# EAGLE design badge (EAGLE 9.6.2)

## Sheet 1 of 5
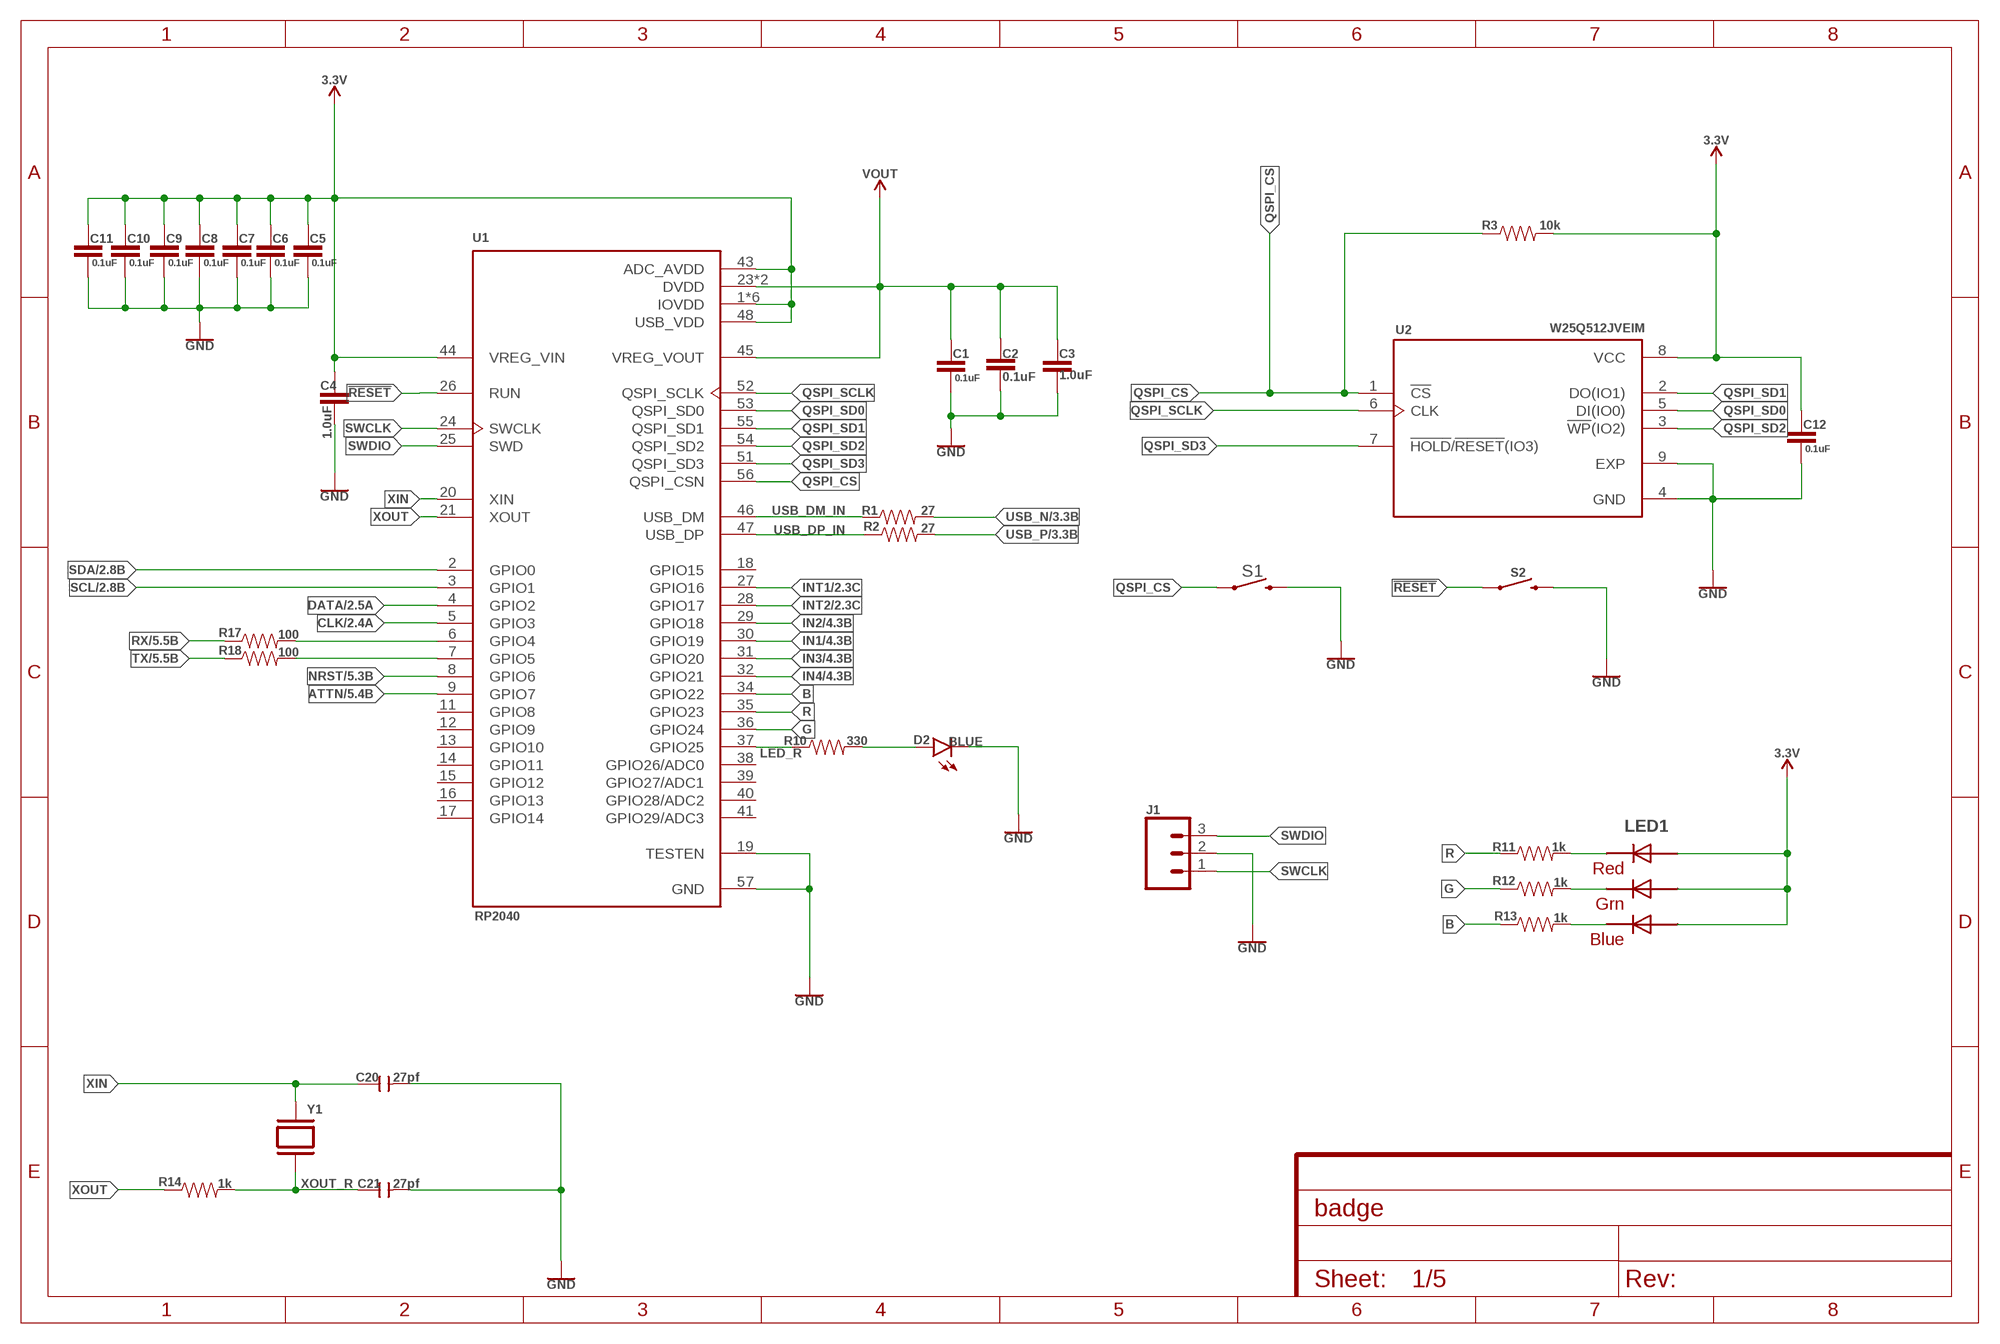
[diagram p0: schematic, sheet 1]

### Parts
C1  0.1uF  0.1UF-0603-25V-(+80/-20%)  [0603]
C2  0.1uF  0.1UF-0603-25V-(+80/-20%)  [0603]
C3  1.0uF  1.0UF-0603-16V-10%  [0603]
C4  1.0uF  1.0UF-0603-16V-10%  [0603]
C5  0.1uF  0.1UF-0603-25V-(+80/-20%)  [0603]
C6  0.1uF  0.1UF-0603-25V-(+80/-20%)  [0603]
C7  0.1uF  0.1UF-0603-25V-(+80/-20%)  [0603]
C8  0.1uF  0.1UF-0603-25V-(+80/-20%)  [0603]
C9  0.1uF  0.1UF-0603-25V-(+80/-20%)  [0603]
C10  0.1uF  0.1UF-0603-25V-(+80/-20%)  [0603]
C11  0.1uF  0.1UF-0603-25V-(+80/-20%)  [0603]
C12  0.1uF  0.1UF-0603-25V-(+80/-20%)  [0603]
C20  27pf  CERAMIC-27PF-50V-5%-NPO(0603)  [C0603]
C21  27pf  CERAMIC-27PF-50V-5%-NPO(0603)  [C0603]
D2  BLUE  LED-BLUE0603  [LED-0603]
J1  CONN_03LONGPADS  [1X03_LONGPADS]
LED1  RGBLED5050  [RGBLED5050]
R1  27  27OHM-0603-1/10W-1%  [0603]
R2  27  27OHM-0603-1/10W-1%  [0603]
R3  10k  10KOHM-0603-1/10W-1%  [0603]
R10  330  330OHM-0603-1/10W-1%  [0603]
R11  1k  1KOHM-0603-1/10W-1%  [0603]
R12  1k  1KOHM-0603-1/10W-1%  [0603]
R13  1k  1KOHM-0603-1/10W-1%  [0603]
R14  1k  1KOHM-0603-1/10W-1%  [0603]
R17  100  100OHM-0603-1/4W-5%  [0603]
R18  100  100OHM-0603-1/4W-5%  [0603]
S1  MOMENTARY-SWITCH-SPST-SMD-6.0X3.5MM  [TACTILE_SWITCH_SMD_6.0X3.5MM]
S2  MOMENTARY-SWITCH-SPST-SMD-6.0X3.5MM  [TACTILE_SWITCH_SMD_6.0X3.5MM]
U1  RP2040  [QFN40P700X700X90-57N]
U2  W25Q512JVEIM  [SON127P600X800X80-9N]
Y1  ABLS-12.000MHZ-B4-T  [XTAL_ABLS-12.000MHZ-B4-T]

### Nets
3.3V: C4.1 C5.1 C6.1 C7.1 C8.1 C9.1 C10.1 C11.1 C12.1 LED1.1(GREEN_A) LED1.2(RED_A) LED1.3(BLUE_A) R3.2 U1.1(IOVDD) U1.10(IOVDD) U1.22(IOVDD) U1.33(IOVDD) U1.42(IOVDD) U1.43(ADC_AVDD) U1.44(VREG_VIN) U1.48(USB_VDD) U1.49(IOVDD) U2.8(VCC) ; also sheet 2,3,5
!RESET: S2.1 U1.26(RUN)
ATTN: U1.9(GPIO7) ; also sheet 5
B: R13.1 U1.34(GPIO22)
CLK: U1.5(GPIO3) ; also sheet 2
DATA: U1.4(GPIO2) ; also sheet 2
G: R12.1 U1.36(GPIO24)
GND: C1.2 C2.2 C3.2 C4.2 C5.2 C6.2 C7.2 C8.2 C9.2 C10.2 C11.2 C12.2 C20.2 C21.2 D2.C J1.2 S1.2 S2.2 U1.19(TESTEN) U1.57(GND) U2.4(GND) U2.9(EXP) ; also sheet 2,3,4,5
IN1: U1.30(GPIO19) ; also sheet 4
IN2: U1.29(GPIO18) ; also sheet 4
IN3: U1.31(GPIO20) ; also sheet 4
IN4: U1.32(GPIO21) ; also sheet 4
INT1: U1.27(GPIO16) ; also sheet 2
INT2: U1.28(GPIO17) ; also sheet 2
LED_R: R10.1 U1.37(GPIO25)
N$7: D2.A R10.2
N$9: LED1.5(RED_C) R11.2
N$10: LED1.6(GREEN_C) R12.2
N$11: LED1.4(BLUE_C) R13.2
N$15: R17.2 U1.6(GPIO4)
N$17: R18.2 U1.7(GPIO5)
NRST: U1.8(GPIO6) ; also sheet 5
QSPI_CS: R3.1 S1.1 U1.56(QSPI_CSN) U2.1(!CS)
QSPI_SCLK: U1.52(QSPI_SCLK) U2.6(CLK)
QSPI_SD0: U1.53(QSPI_SD0) U2.5(DI(IO0))
QSPI_SD1: U1.55(QSPI_SD1) U2.2(DO(IO1))
QSPI_SD2: U1.54(QSPI_SD2) U2.3(!WP!(IO2))
QSPI_SD3: U1.51(QSPI_SD3) U2.7(!HOLD!/!RESET!(IO3))
R: R11.1 U1.35(GPIO23)
RX: R17.1 ; also sheet 5
SCL: U1.3(GPIO1) ; also sheet 2,5
SDA: U1.2(GPIO0) ; also sheet 2,5
SWCLK: J1.1 U1.24(SWCLK)
SWDIO: J1.3 U1.25(SWD)
TX: R18.1 ; also sheet 5
USB_DM_IN [USB]: R1.1 U1.46(USB_DM)
USB_DP_IN [USB]: R2.1 U1.47(USB_DP)
USB_N [USB]: R1.2 ; also sheet 3
USB_P [USB]: R2.2 ; also sheet 3
VOUT: C1.1 C2.1 C3.1 U1.23(DVDD) U1.45(VREG_VOUT) U1.50(DVDD)
XIN: C20.1 U1.20(XIN) Y1.2
XOUT: R14.1 U1.21(XOUT)
XOUT_R: C21.1 R14.2 Y1.1
Unconnected: U1.11(GPIO8) U1.12(GPIO9) U1.13(GPIO10) U1.14(GPIO11) U1.15(GPIO12) U1.16(GPIO13) U1.17(GPIO14) U1.18(GPIO15) U1.38(GPIO26/ADC0) U1.39(GPIO27/ADC1) U1.40(GPIO28/ADC2) U1.41(GPIO29/ADC3)

## Sheet 2 of 5
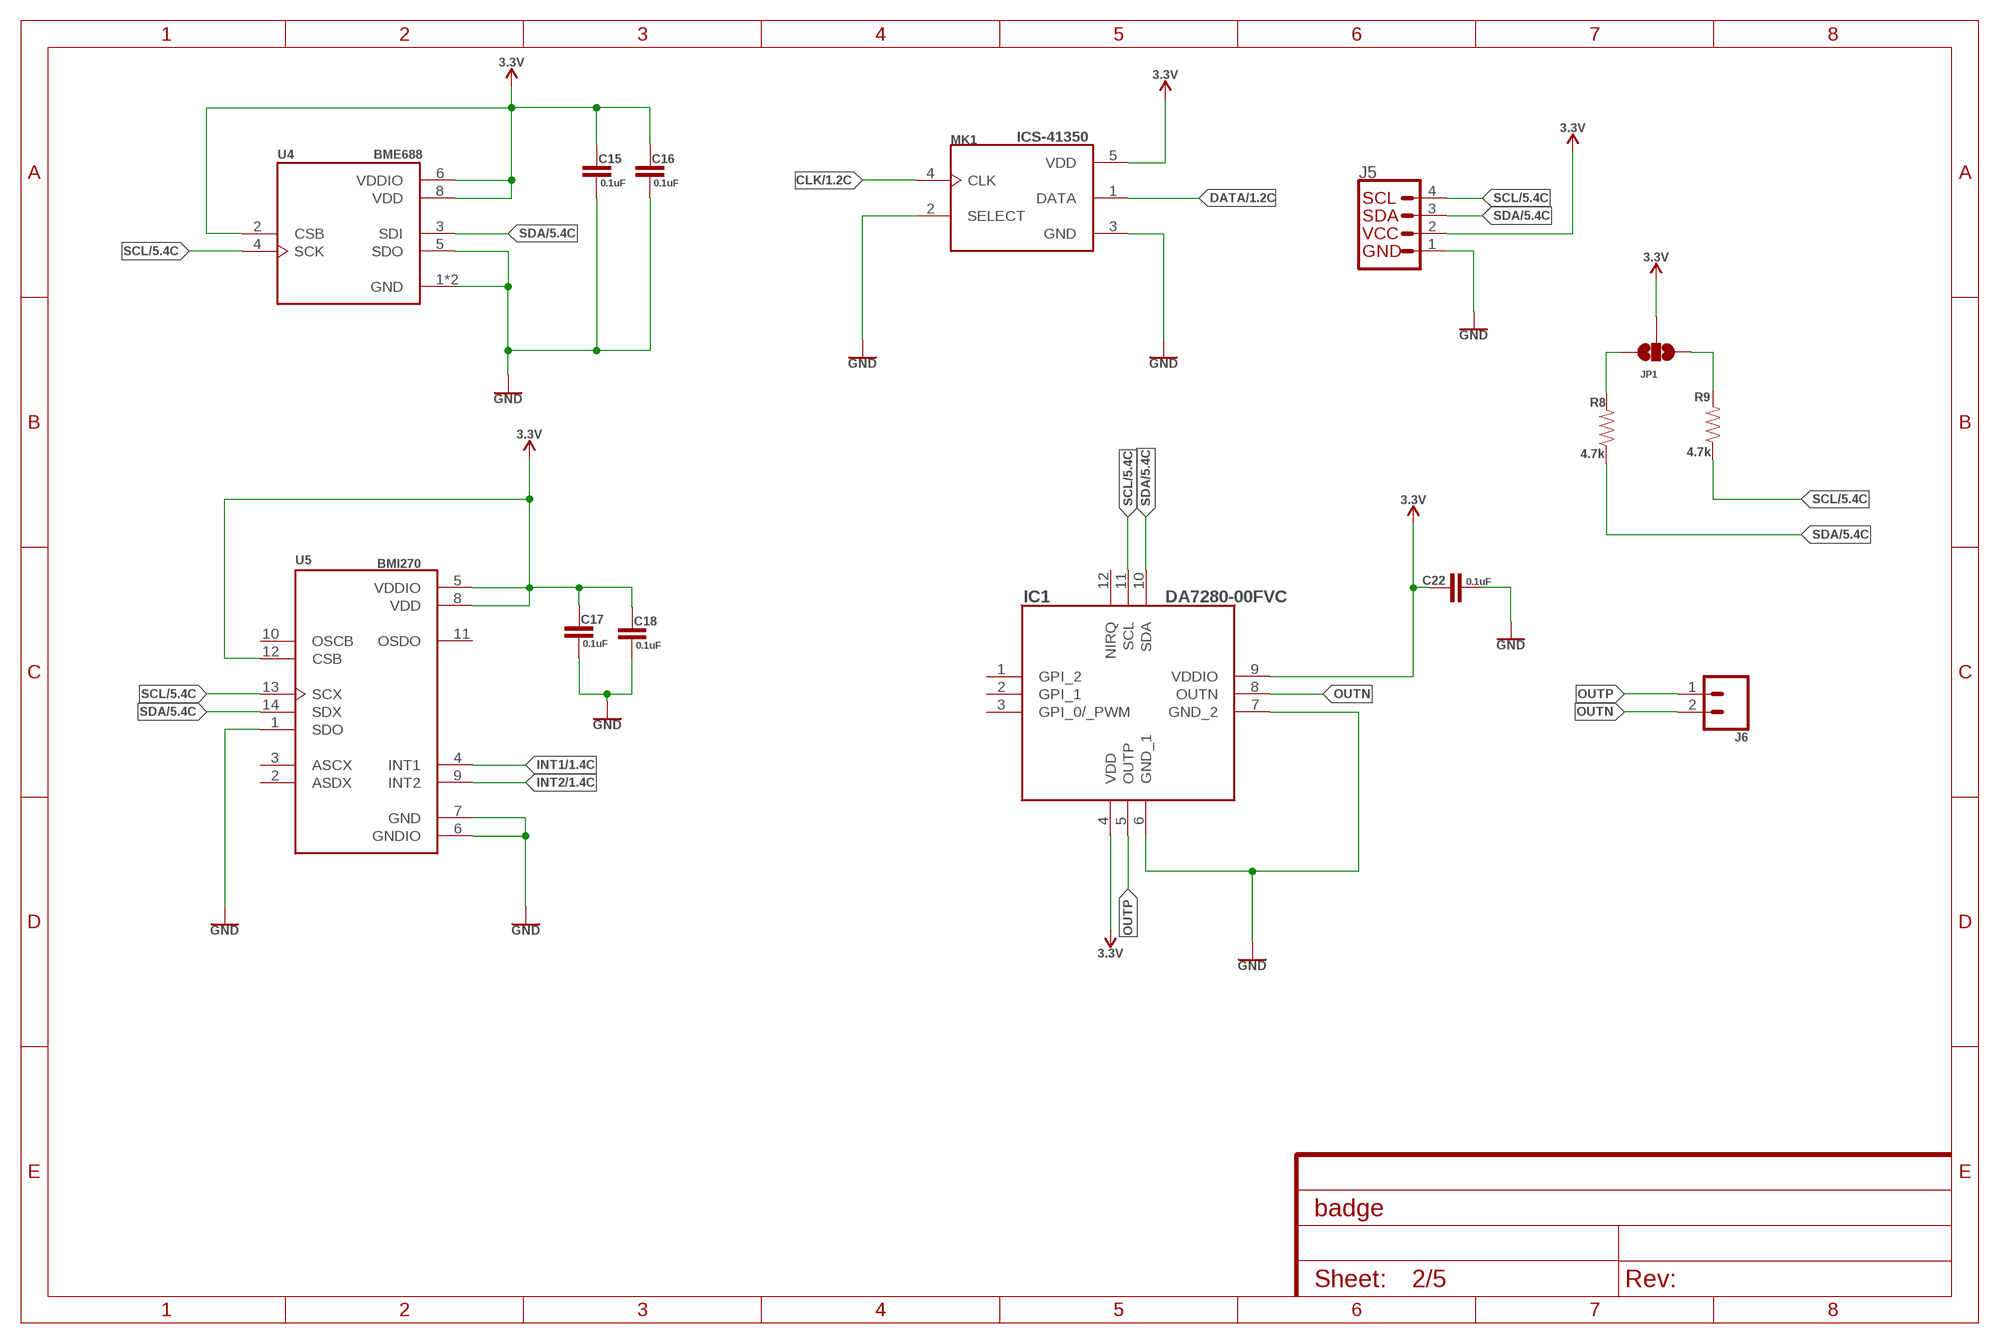
[diagram p1: schematic, sheet 2]

### Parts
C15  0.1uF  0.1UF-0603-25V-(+80/-20%)  [0603]
C16  0.1uF  0.1UF-0603-25V-(+80/-20%)  [0603]
C17  0.1uF  0.1UF-0603-25V-(+80/-20%)  [0603]
C18  0.1uF  0.1UF-0603-25V-(+80/-20%)  [0603]
C22  0.1uF  0.1UF-0603-25V-(+80/-20%)  [0603]
IC1  DA7280-00FVC  [QFN65P300X300X84-12N]
J5  QWIIC_CONNECTORJS-1MM  [1X04_1MM_RA]
J6  CONN_02  [1X02]
JP1  JUMPER-SMT_3_NO_SILK  [SMT-JUMPER_3_NO_SILK]
MK1  ICS-41350  [MIC_ICS-41350]
R8  4.7k  4.7KOHM-0603-1/10W-1%  [0603]
R9  4.7k  4.7KOHM-0603-1/10W-1%  [0603]
U4  BME688  [IC_BME688]
U5  BMI270  [XDCR_BMI270]

### Nets
3.3V: C15.1 C16.1 C17.1 C18.1 C22.1 IC1.4(VDD) IC1.9(VDDIO) J5.2(VCC) JP1.2 MK1.5(VDD) U4.2(CSB) U4.6(VDDIO) U4.8(VDD) U5.5(VDDIO) U5.8(VDD) U5.12(CSB) ; also sheet 1,3,5
CLK: MK1.4(CLK) ; also sheet 1
DATA: MK1.1(DATA) ; also sheet 1
GND: C15.2 C16.2 C17.2 C18.2 C22.2 IC1.6(GND_1) IC1.7(GND_2) J5.1(GND) MK1.2(SELECT) MK1.3(GND) U4.1(GND) U4.5(SDO) U4.7(GND) U5.1(SDO) U5.6(GNDIO) U5.7(GND) ; also sheet 1,3,4,5
INT1: U5.4(INT1) ; also sheet 1
INT2: U5.9(INT2) ; also sheet 1
N$1: JP1.3 R8.2
N$2: JP1.1 R9.2
OUTN: IC1.8(OUTN) J6.2
OUTP: IC1.5(OUTP) J6.1
SCL: IC1.11(SCL) J5.4(SCL) R9.1 U4.4(SCK) U5.13(SCX) ; also sheet 1,5
SDA: IC1.10(SDA) J5.3(SDA) R8.1 U4.3(SDI) U5.14(SDX) ; also sheet 1,5
Unconnected: IC1.1(GPI_2) IC1.2(GPI_1) IC1.3(GPI_0/_PWM) IC1.12(NIRQ) U5.2(ASDX) U5.3(ASCX) U5.10(OSCB) U5.11(OSDO)

## Sheet 3 of 5
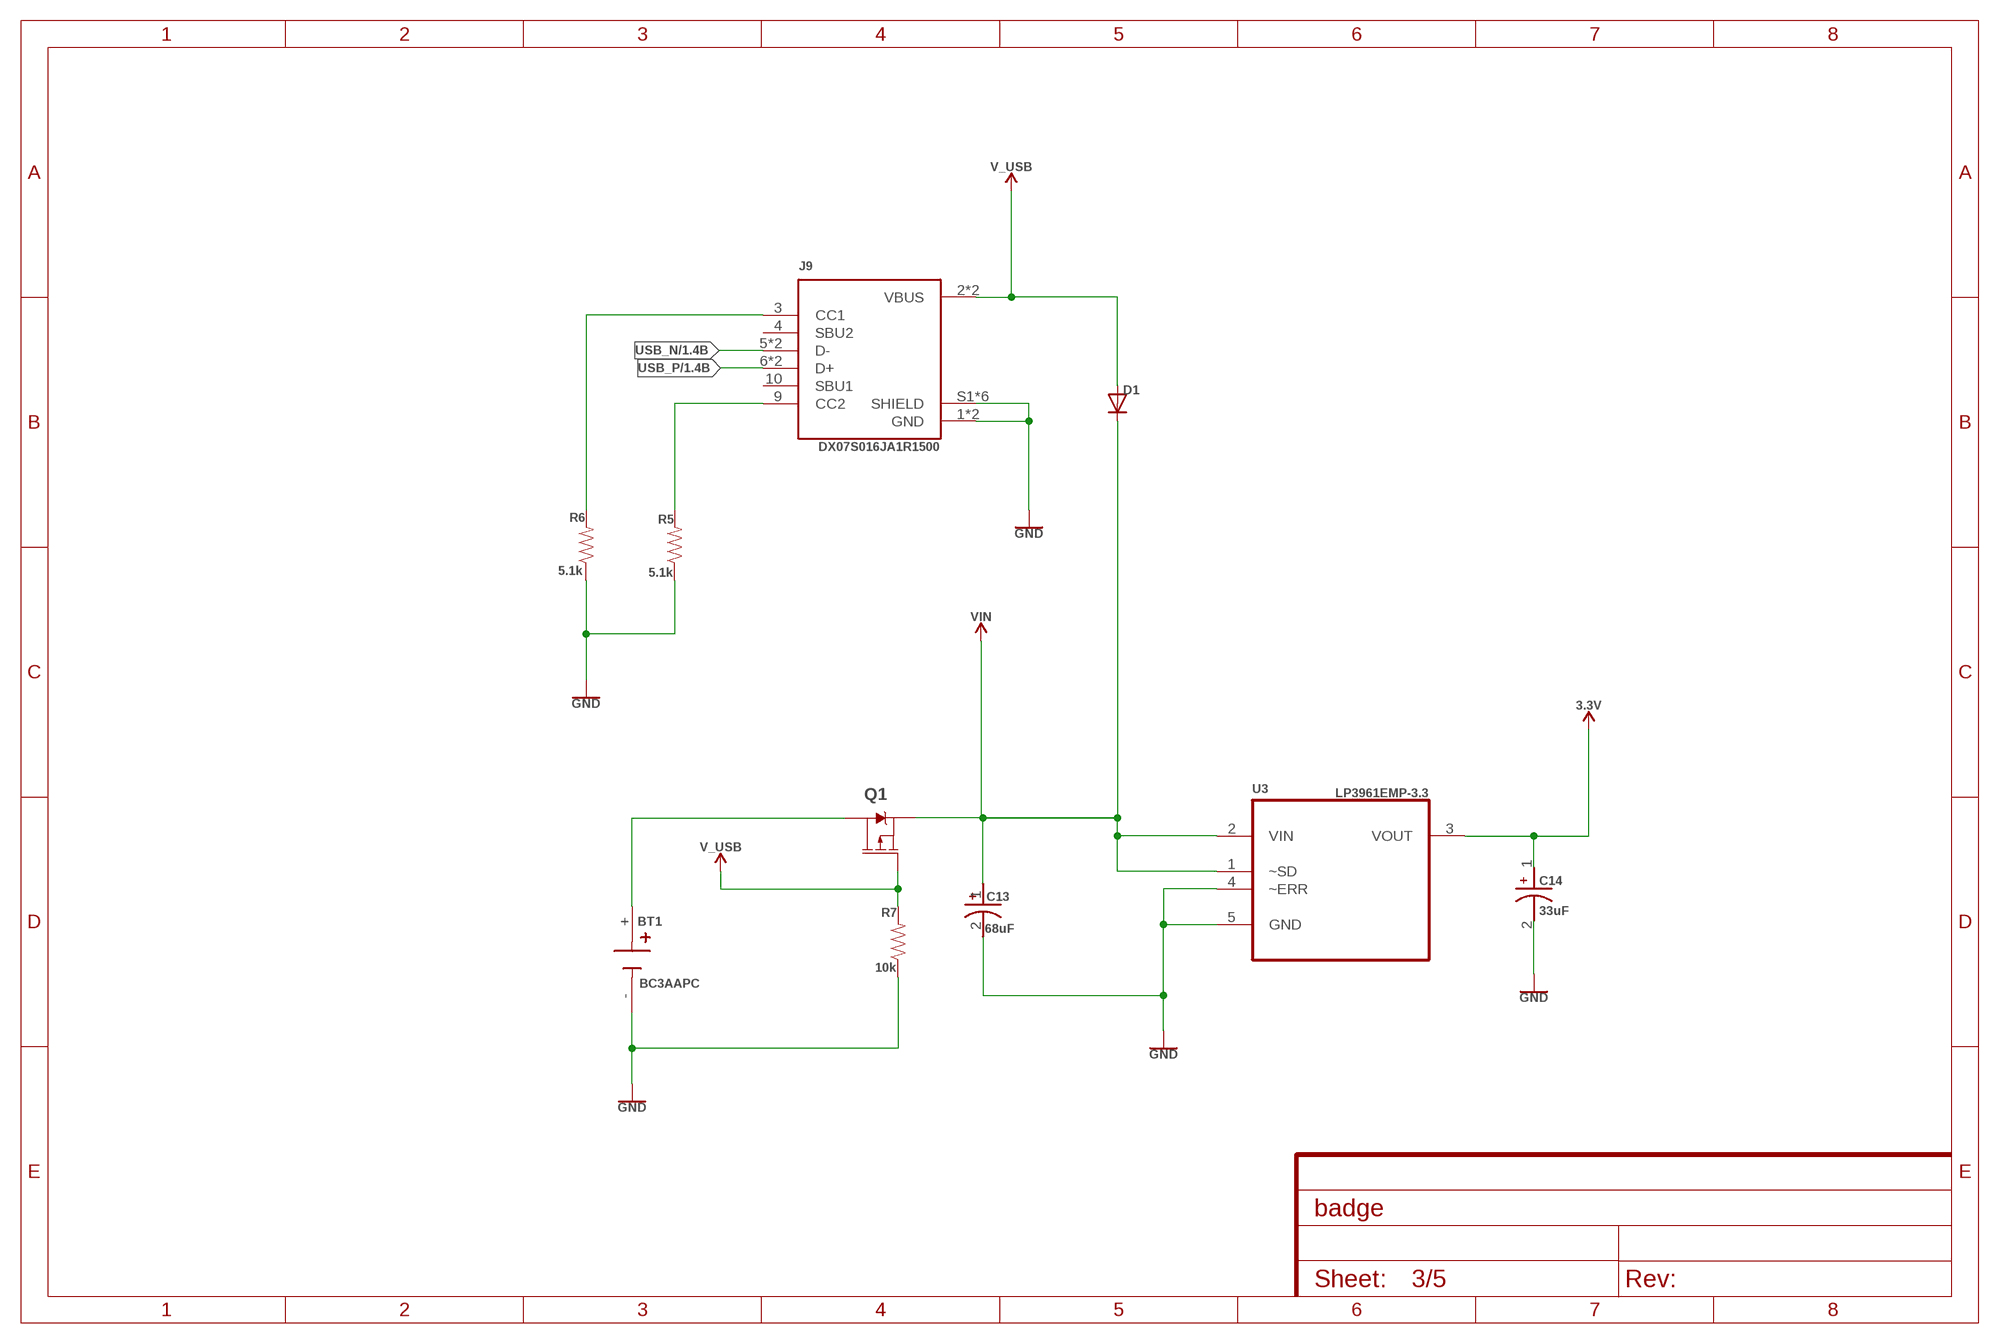
[diagram p2: schematic, sheet 3]

### Parts
BT1  BC3AAPC  [BAT_BC3AAPC]
C13  68uF  T491A686M006AT  [CAPMP3216X180N]
C14  33uF  TAJA336K006RNJ  [CAPMP3216X180N]
D1  DIODESOD-123  [SOD-123]
J9  DX07S016JA1R1500  [JAE_DX07S016JA1R1500]
Q1  2.5A/30V/105mΩ  MOSFET_PCH-DMG2307L  [SOT23-3]
R5  5.1k  5.6KOHM-0603-1/10W-1%  [0603]
R6  5.1k  5.6KOHM-0603-1/10W-1%  [0603]
R7  10k  10KOHM-0603-1/10W-1%  [0603]
U3  LP3961EMP-3.3  [SOT150P696X180-5N]

### Nets
3.3V: C14.1 U3.3(VOUT) ; also sheet 1,2,5
GND: BT1.- C13.2 C14.2 J9.1(GND) J9.12(GND) J9.S1(SHIELD) J9.S2(SHIELD) J9.S3(SHIELD) J9.S4(SHIELD) J9.S5(SHIELD) J9.S6(SHIELD) R5.1 R6.1 R7.1 U3.4(~ERR) U3.5(GND) ; also sheet 1,2,4,5
N$5: BT1.+ Q1.3(D)
N$14: J9.3(CC1) R6.2
N$16: J9.9(CC2) R5.2
USB_N [USB]: J9.5(D-) J9.8(D-) ; also sheet 1
USB_P [USB]: J9.6(D+) J9.7(D+) ; also sheet 1
V_USB: D1.A J9.2(VBUS) J9.11(VBUS) Q1.1(G) R7.2
VIN: C13.1 D1.C Q1.2(S) U3.1(~SD) U3.2(VIN) ; also sheet 4
Unconnected: J9.4(SBU2) J9.10(SBU1)

## Sheet 4 of 5
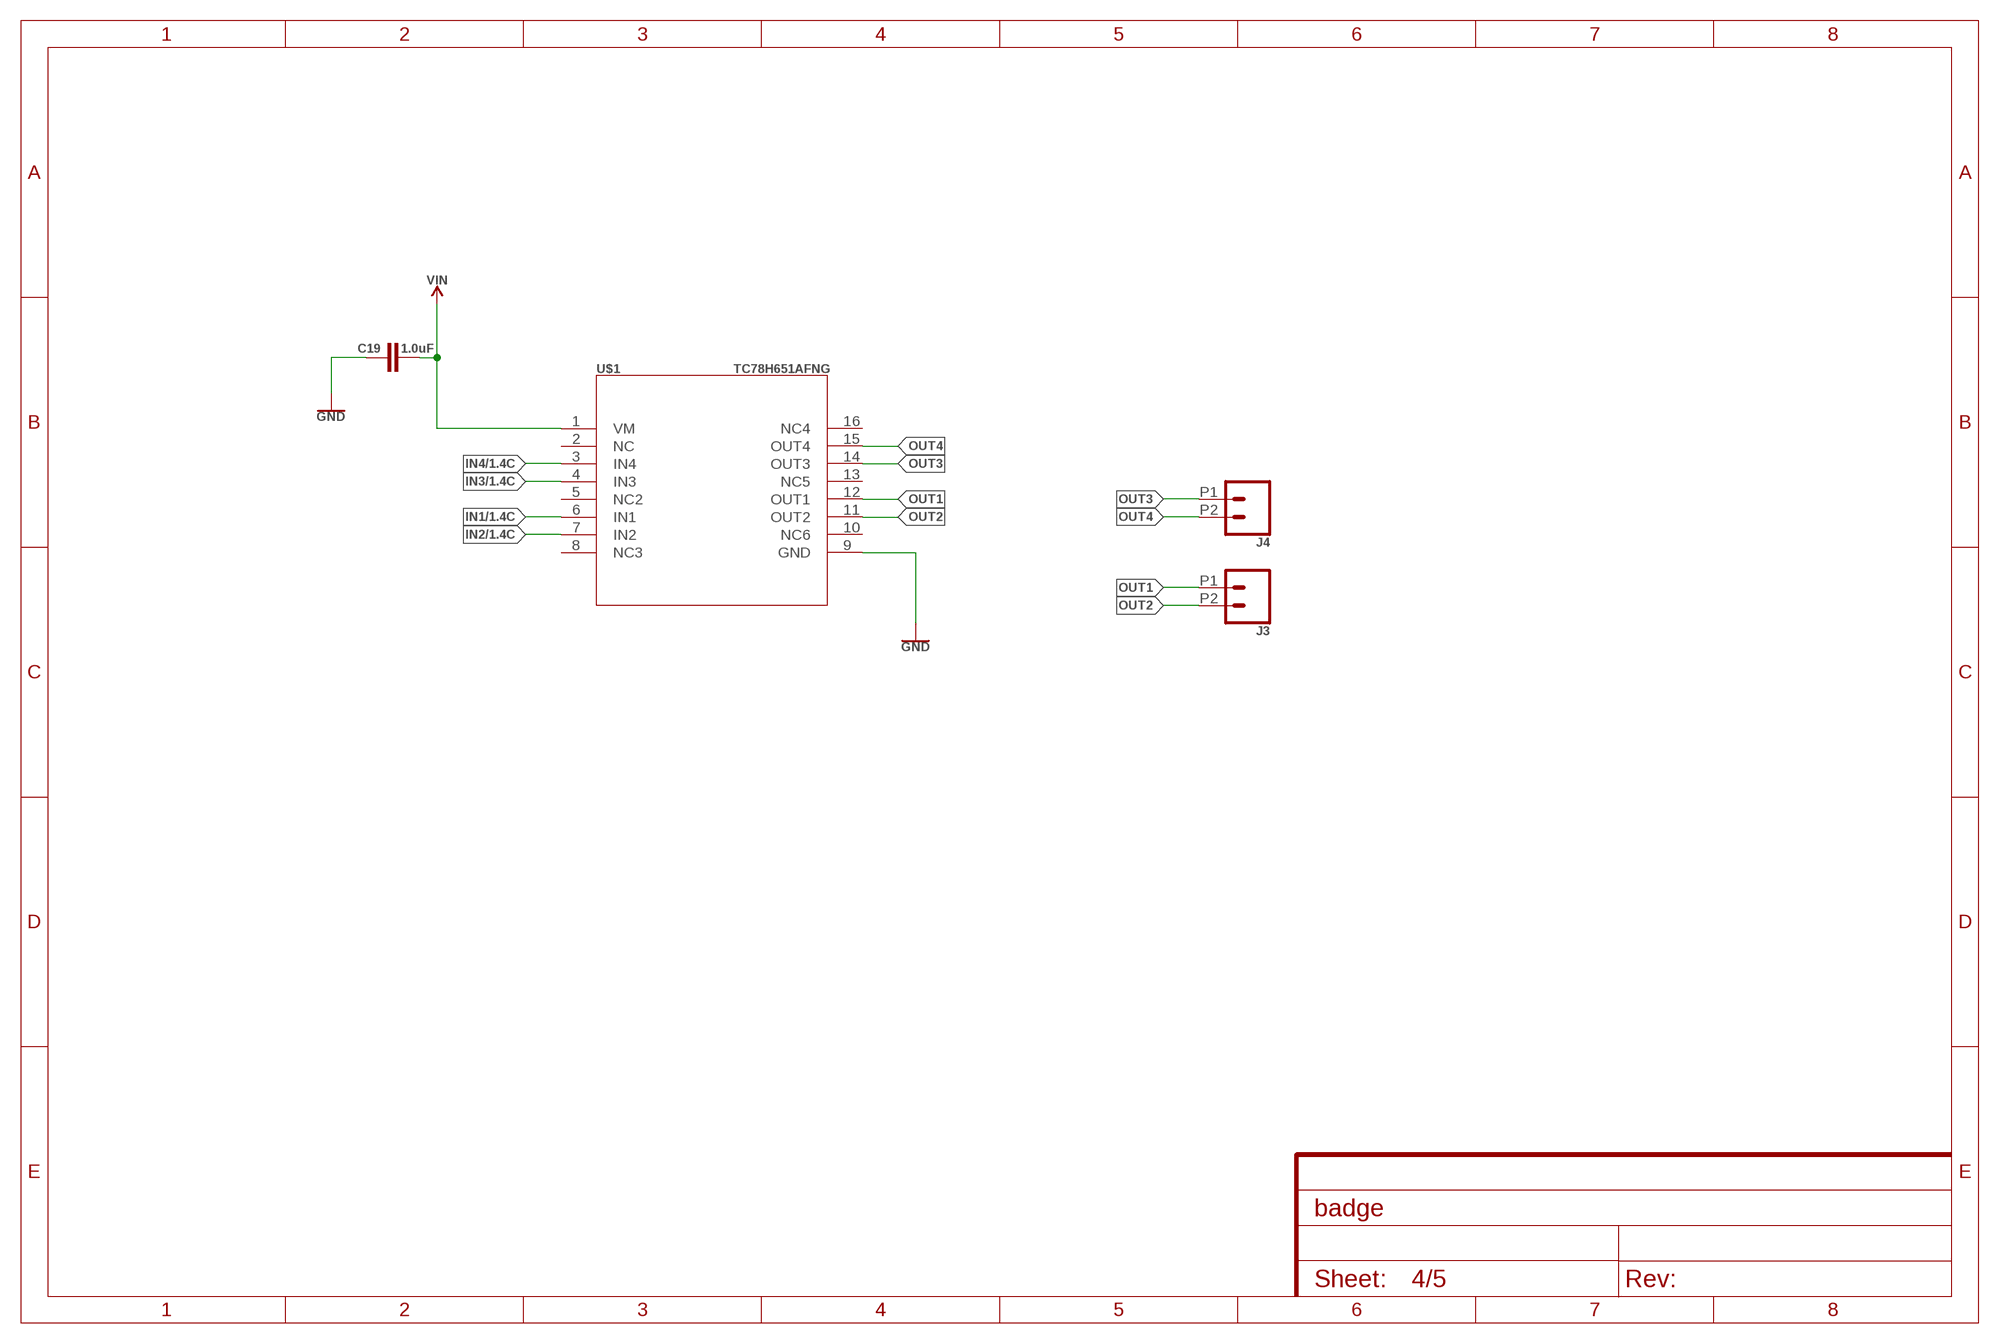
[diagram p3: schematic, sheet 4]

### Parts
C19  1.0uF  1.0UF-0603-16V-10%  [0603]
J3  CONN_022.54MM_SCREWTERM  [1X02_2.54_SCREWTERM]
J4  CONN_022.54MM_SCREWTERM  [1X02_2.54_SCREWTERM]
U$1  TC78H651AFNG  [P-TSSOP16-0505-0.65-001]

### Nets
GND: C19.1 U$1.9(GND) ; also sheet 1,2,3,5
IN1: U$1.6(IN1) ; also sheet 1
IN2: U$1.7(IN2) ; also sheet 1
IN3: U$1.4(IN3) ; also sheet 1
IN4: U$1.3(IN4) ; also sheet 1
OUT1: J3.P1 U$1.12(OUT1)
OUT2: J3.P2 U$1.11(OUT2)
OUT3: J4.P1 U$1.14(OUT3)
OUT4: J4.P2 U$1.15(OUT4)
VIN: C19.2 U$1.1(VM) ; also sheet 3
Unconnected: U$1.2(NC) U$1.5(NC2) U$1.8(NC3) U$1.10(NC6) U$1.13(NC5) U$1.16(NC4)

## Sheet 5 of 5
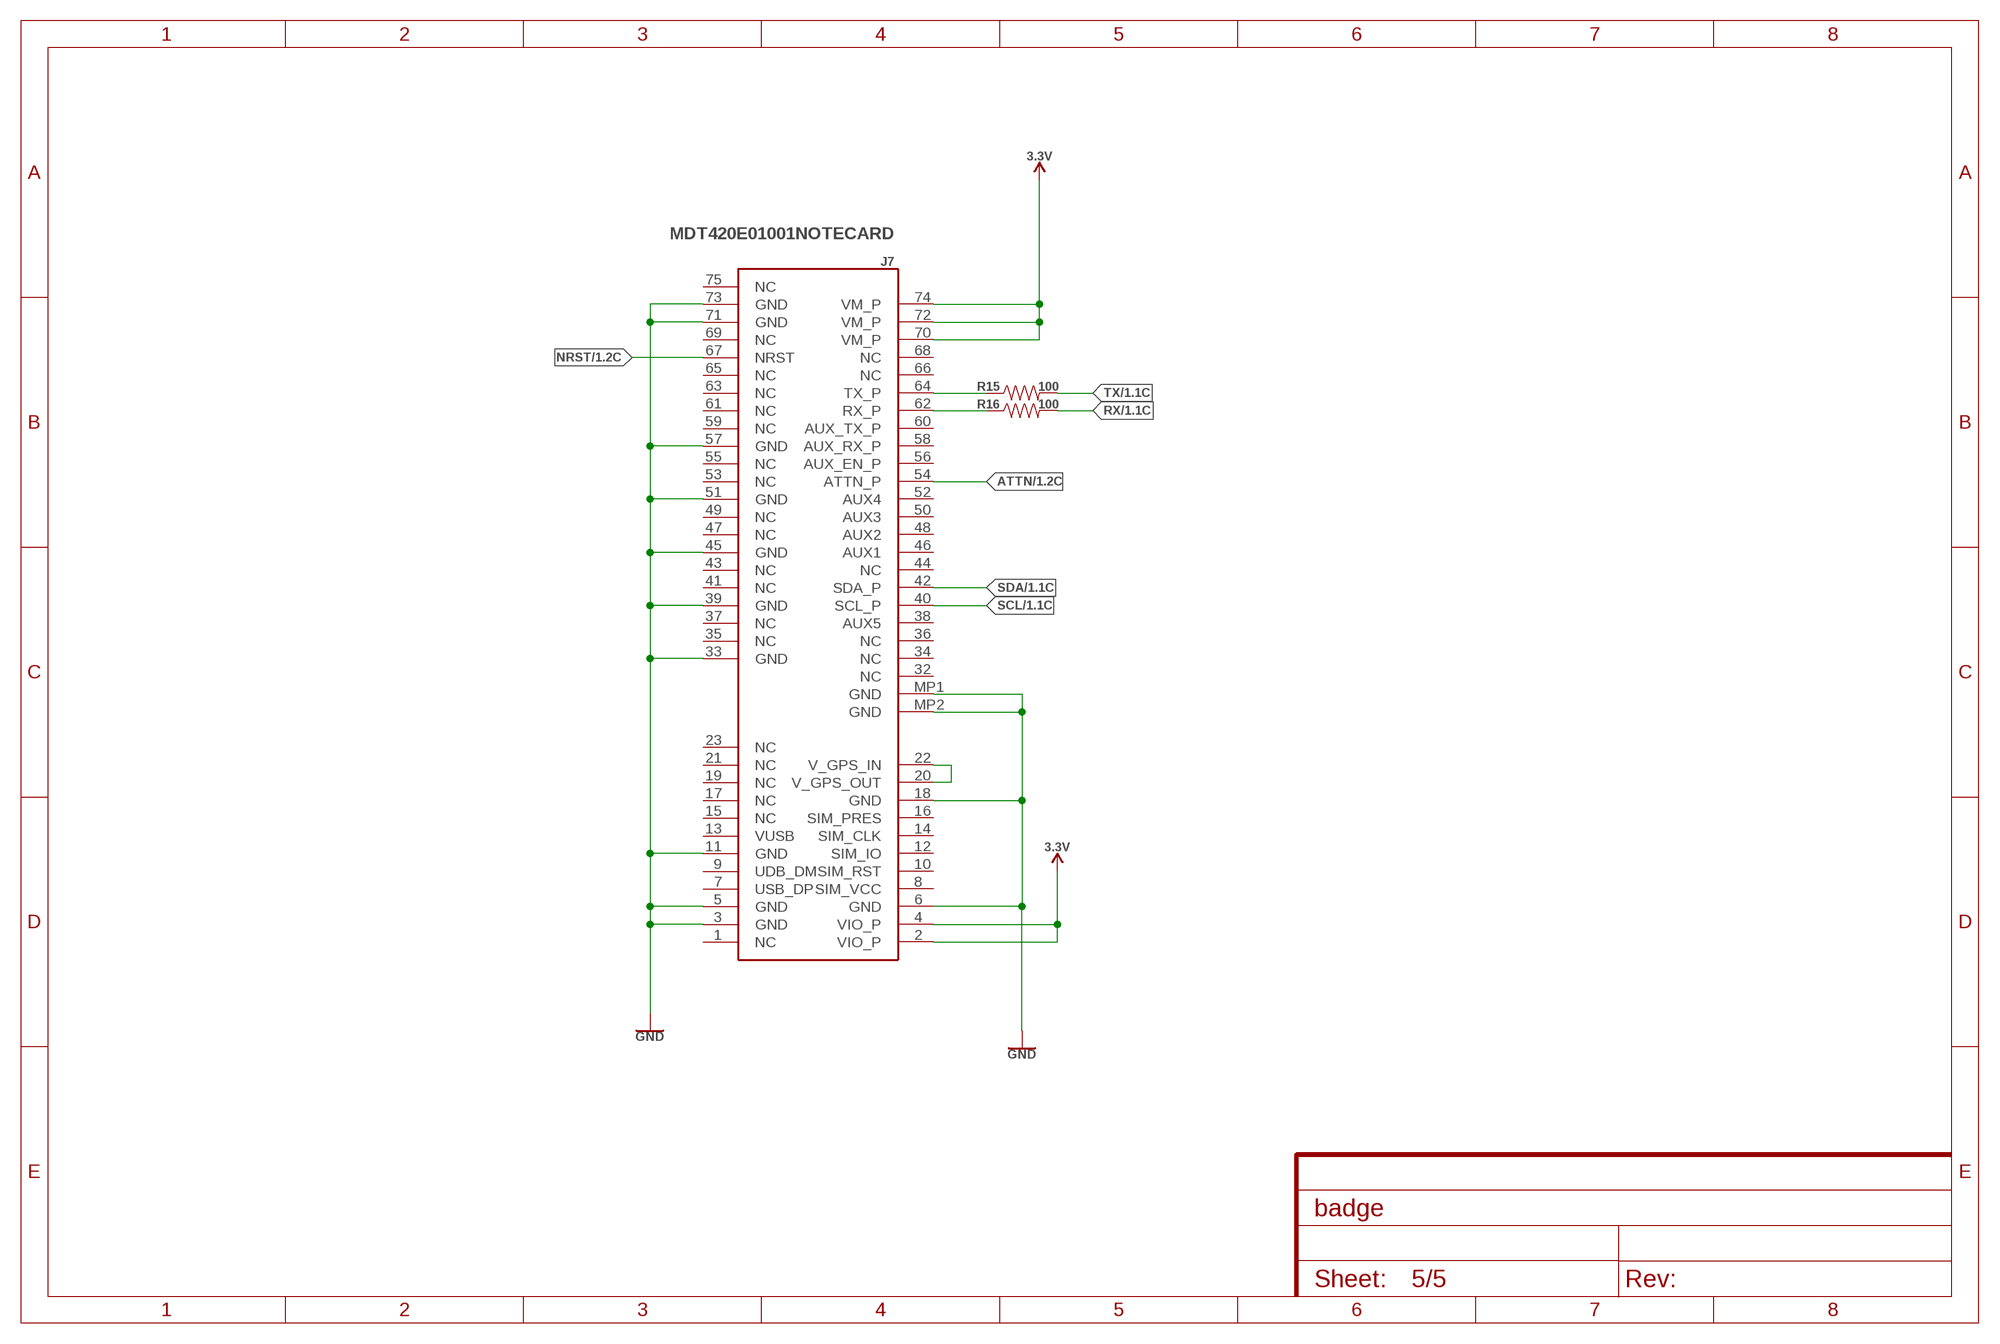
[diagram p4: schematic, sheet 5]

### Parts
J7  MDT420E01001NOTECARD  [NOTECARD]
R15  100  100OHM-0603-1/4W-5%  [0603]
R16  100  100OHM-0603-1/4W-5%  [0603]

### Nets
3.3V: J7.2(VIO_P) J7.4(VIO_P) J7.70(VM_P) J7.72(VM_P) J7.74(VM_P) ; also sheet 1,2,3
ATTN: J7.54(ATTN_P) ; also sheet 1
GND: J7.3(GND) J7.5(GND) J7.6(GND) J7.11(GND) J7.18(GND) J7.33(GND) J7.39(GND) J7.45(GND) J7.51(GND) J7.57(GND) J7.71(GND) J7.73(GND) J7.MP1(GND) J7.MP2(GND) ; also sheet 1,2,3,4
N$3: J7.64(TX_P) R15.1
N$4: J7.62(RX_P) R16.1
N$6: J7.20(V_GPS_OUT) J7.22(V_GPS_IN)
NRST: J7.67(NRST) ; also sheet 1
RX: R16.2 ; also sheet 1
SCL: J7.40(SCL_P) ; also sheet 1,2
SDA: J7.42(SDA_P) ; also sheet 1,2
TX: R15.2 ; also sheet 1
Unconnected: J7.1(NC) J7.7(USB_DP) J7.8(SIM_VCC) J7.9(UDB_DM) J7.10(SIM_RST) J7.12(SIM_IO) J7.13(VUSB) J7.14(SIM_CLK) J7.15(NC) J7.16(SIM_PRES) J7.17(NC) J7.19(NC) J7.21(NC) J7.23(NC) J7.32(NC) J7.34(NC) J7.35(NC) J7.36(NC) J7.37(NC) J7.38(AUX5) J7.41(NC) J7.43(NC) J7.44(NC) J7.46(AUX1) J7.47(NC) J7.48(AUX2) J7.49(NC) J7.50(AUX3) J7.52(AUX4) J7.53(NC) J7.55(NC) J7.56(AUX_EN_P) J7.58(AUX_RX_P) J7.59(NC) J7.60(AUX_TX_P) J7.61(NC) J7.63(NC) J7.65(NC) J7.66(NC) J7.68(NC) J7.69(NC) J7.75(NC)

## Library data of the parts
BT1 = BC3AAPC:BC3AAPC: Holder Batt 3-AA Cells Pc Mnt Check availability <https://pricing.snapeda.com/parts/BC3AAPC/MPD/view-part?ref=eda>; AVAILABILITY: In Stock; DESCRIPTION: BATTERY HOLDER AA 3 CELL PC PIN; MF: MPD; MP: BC3AAPC; PACKAGE: None; PRICE: None; PURCHASE-URL: https://pricing.snapeda.com/search/part/BC3AAPC/?ref=eda
C1 C2 C5-C12 C15-C18 C22 = SparkFun-Capacitors:0.1UF: 0.1µF ceramic capacitors A capacitor is a passive two-terminal electrical component used to store electrical energy temporarily in an electric field.; PROD_ID: CAP-00810
C3 C4 C19 = SparkFun-Capacitors:1.0UF: 1µF ceramic capacitors A capacitor is a passive two-terminal electrical component used to store electrical energy temporarily in an electric field.; PROD_ID: CAP-00868
C13 = T491A686M006AT:T491A686M006AT: 4.7µF Molded Tantalum Capacitors 25V 1206 (3216 Metric) 6Ohm Check availability <https://pricing.snapeda.com/parts/T491A686M006AT/KEMET/view-part?ref=eda>; AVAILABILITY: In Stock; DESCRIPTION: 68 µF Molded Tantalum Capacitors 6.3 V 1206 (3216 Metric) 4Ohm; MF: KEMET; MP: T491A686M006AT; PACKAGE: SMD-2 KEMET; PRICE: None; PURCHASE-URL: https://pricing.snapeda.com/search/part/T491A686M006AT/?ref=eda
C14 = TAJA336K006RNJ:TAJA336K006RNJ: 1µF Molded Tantalum Capacitors 16V 1206 (3216 Metric) 11Ohm @ 100kHz Check availability <https://pricing.snapeda.com/parts/TAJA336K006RNJ/AVX/view-part?ref=eda>; AVAILABILITY: In Stock; DESCRIPTION: 33 µF Molded Tantalum Capacitors 6.3 V 1206 (3216 Metric) 2.2Ohm; MF: AVX; MP: TAJA336K006RNJ; PACKAGE: 1206 AVX Corporation; PRICE: None; PURCHASE-URL: https://pricing.snapeda.com/search/part/TAJA336K006RNJ/?ref=eda
C20 C21 = OPL_Capacitor:CERAMIC-27PF-50V-5%-NPO(0603): 302010142; MPN: CC0603JRNPO9BN270
D1 = adafruit:DIODE: Diode SMADIODE - SMA Surface Mount Package 20V 1A Schottky Diode Digikey: 641-1014-6-ND DO-1N4148 - Through Hole Small Current Diode SOD-123 20V 1 A (.5mV Vf) Schottky Diode - Digikey: MBRX120TPMSCT-ND SOD-323 10V 570mA (.38mV Vf, 3ns) Schottky Diode - Digikey: ZLLS410CT-ND SOD-523 30V 30mA Schottky Diode (RB751S-40TE61) - Digikey: RB751S-40TE61CT-ND SOT23-R/W - SOT23 Package (R = Solder Paste/Reflow Ovens, W = Hand-Soldering) BAT54Film 40V 300mA - Digikey: 497-7162-1-ND
D2 = SparkFun-LED:LED-BLUE: Blue SMD LED Used in manufacturing of various products at SparkFun Packages: 0603 - SMD 0603 package [Product Link] <http://www.digikey.com/product-detail/en/SMLE12BC7TT86/511-1589-2-ND/1641808> 1206 - SMD1206 package [Product Link] <http://www.digikey.com/product-detail/en/lite-on-inc/LTST-C150TBKT/160-1643-1-ND/573584> SparkFun Products: ESP8266 Thing-Dev Board <https://www.sparkfun.com/products/13711> RedBoard <https://www.sparkfun.com/products/12757>; PROD_ID: DIO-08575
IC1 = SamacSys_Parts:DA7280-00FVC: The DA7280 high-definition (HD) haptic driver combines custom drive sequences, on- and off-resonance, at up to 1kHz. The DA7280 can drive both ERM and LRA (narrow and wideband) actuators and track resonance up to 300Hz to drive the most complex click/vibration touch effects in a wide range of applications.The DA7280 combines very low idle current consumption (360nA) with low-latency trigger inputs to minimize the delay after button presses when an application process is in deep sleep.Benefits Constant reson Source: Datasheet <https://www.renesas.com/us/en/products/interface-connectivity/haptic-drivers/da7280-low-power-high-definition-haptic-driver-next-generation-human-machine-interfaces>; DESCRIPTION: The DA7280 high-definition (HD) haptic driver combines custom drive sequences, on- and off-resonance, at up to 1kHz. The DA7280 can drive both ERM and LRA (narrow and wideband) actuators and track resonance up to 300Hz to drive the most complex click/vibration touch effects in a wide range of applications.The DA7280 combines very low idle current consumption (360nA) with low-latency trigger inputs to minimize the delay after button presses when an application process is in deep sleep.Benefits Constant reson; HEIGHT: 0.84mm; MANUFACTURER_NAME: Renesas Electronics; MANUFACTURER_PART_NUMBER: DA7280-00FVC
J1 = SparkFun-Connectors:CONN_03: Multi connection point. Often used as Generic Header-pin footprint for 0.1 inch spaced/style header connections On any of the 0.1 inch spaced packages, you can populate with these: Break Away Headers - Straight <https://www.sparkfun.com/products/116> (PRT-00116) Break Away Male Headers - Right Angle <https://www.sparkfun.com/products/553> (PRT-00553) Female Headers <https://www.sparkfun.com/products/115> (PRT-00115) Break Away Headers - Machine Pin <https://www.sparkfun.com/products/117> (PRT-00117) Break Away Female Headers - Swiss Machine Pin <https://www.sparkfun.com/products/743> (PRT-00743) Stackable Header - 3 Pin (Female, 0.1") <https://www.sparkfun.com/products/13875> (PRT-13875) For SCREWTERMINALS and SPRING TERMINALS visit here: Screw Terimnals on SparkFun.com <https://www.sparkfun.com/search/results?term=Screw+Terminals> (5mm/3.5mm/2.54mm spacing) This device is also useful as a general connection point to wire up your design to another part of your project. Our various solder wires solder well into these plated through hole pads. Hook-Up Wire - Assortment (Stranded, 22 AWG) <https://www.sparkfun.com/products/11375> (PRT-11375) Hook-Up Wire - Assortment (Solid Core, 22 AWG) <https://www.sparkfun.com/products/11367> (PRT-11367) View the entire wire category on our website here <https://www.sparkfun.com/categories/141> Special notes: Molex polarized connector foot print use with SKU : PRT-08232 with associated crimp pins and housings.
J3 J4 J6 = SparkFun-Connectors:CONN_02: Multi connection point. Often used as Generic Header-pin footprint for 0.1 inch spaced/style header connections On any of the 0.1 inch spaced packages, you can populate with these: Break Away Headers - Straight <https://www.sparkfun.com/products/116> (PRT-00116) Break Away Male Headers - Right Angle <https://www.sparkfun.com/products/553> (PRT-00553) Female Headers <https://www.sparkfun.com/products/115> (PRT-00115) Break Away Headers - Machine Pin <https://www.sparkfun.com/products/117> (PRT-00117) Break Away Female Headers - Swiss Machine Pin <https://www.sparkfun.com/products/743> (PRT-00743) For SCREWTERMINALS and SPRING TERMINALS visit here: Screw Terimnals on SparkFun.com <https://www.sparkfun.com/search/results?term=Screw+Terminals> (5mm/3.5mm/2.54mm spacing) This device is also useful as a general connection point to wire up your design to another part of your project. Our various solder wires solder well into these plated through hole pads. Hook-Up Wire - Assortment (Stranded, 22 AWG) <https://www.sparkfun.com/products/11375> (PRT-11375) Hook-Up Wire - Assortment (Solid Core, 22 AWG) <https://www.sparkfun.com/products/11367> (PRT-11367) View the entire wire category on our website here <https://www.sparkfun.com/categories/141> Special notes: Molex polarized connector foot print use with: PRT-08233 with associated crimp pins and housings. 2.54_SCREWTERM for use with PRT-10571. 3.5mm Screw Terminal footprints for PRT-08084 5mm Screw Terminal footprints for use with PRT-08432
J5 = SparkFun-Connectors:QWIIC_CONNECTOR: SparkFun I2C Standard Qwiic Connector An SMD 1mm pitch JST connector makes it easy and quick (get it? Qwiic?) to connect I2C devices to each other. The Qwiic system <http://www.sparkfun.com/qwiic> enables fast and solderless connection between popular platforms and various sensors and actuators. We carry 200mm <https://www.sparkfun.com/products/14204>, 100mm <https://www.sparkfun.com/products/14205>, 50mm <https://www.sparkfun.com/products/14206>, and breadboard friendly <https://www.sparkfun.com/products/14207> Qwiic cables. We also offer 10 pcs strips <https://www.sparkfun.com/products/14323> the SMD connectors.
J7 = notecard:MDT420E01001: PCI Express / PCI Connectors 67P SMT RCPT H4.20 E Key, 30u" Au Source: Datasheet <https://componentsearchengine.com/Datasheets/1/MDT420E01001.pdf>
J9 = DX07S016JA1R1500:DX07S016JA1R1500: USB-C (USB TYPE-C) USB 2.0 Receptacle Connector 24 (16+8 Dummy) Position Surface Mount, Right Angle; Through Hole Check availability <https://pricing.snapeda.com/parts/DX07S016JA1R1500/JAE%20Electronics/view-part?ref=eda>; AVAILABILITY: In Stock; DESCRIPTION: USB-C (USB TYPE-C) USB 2.0 Receptacle Connector 24 (16+8 Dummy) Position Surface Mount, Right Angle; Through Hole; MF: JAE Electronics; MP: DX07S016JA1R1500; PACKAGE: None; PRICE: None; PURCHASE-URL: https://pricing.snapeda.com/search/part/DX07S016JA1R1500/?ref=eda
JP1 = SparkFun-Jumpers:JUMPER-SMT_3_NO: Normally open jumper This jumper has three pads in close proximity to each other. Apply solder to close the connection(s).
LED1 = adafruit:RGBLED: For 5050 RGB LEDs, the order of the LEDs may vary from one manufacturer to another!
MK1 = ICS-41350:ICS-41350: Bottom Port PDM Low Power muti-Mode Microphone with high AOP Mode Check availability <https://pricing.snapeda.com/parts/ICS-41350/TDK%20InvenSense/view-part?ref=eda>; AVAILABILITY: In Stock; DESCRIPTION: 50 Hz ~ 40 kHz Digital, PDM Microphone MEMS (Silicon) 1.65 V ~ 3.63 V Omnidirectional (-32dB ±1dB) Solder Pads; MF: TDK InvenSense; MP: ICS-41350; PACKAGE: None; PRICE: None; PURCHASE-URL: https://pricing.snapeda.com/search/part/ICS-41350/?ref=eda
Q1 = SparkFun-DiscreteSemi:MOSFET_PCH: P-channel MOSFETs Voltage controlled devices that allow control of high current outputs. SparkFun Products: SparkFun ESP32 Thing <https://www.sparkfun.com/products/13907> SparkFun ESP8266 Thing <https://www.sparkfun.com/products/13231>; PROD_ID: TRANS-11308
R1 R2 = SparkFun-Resistors:27OHM: 27Ω resistor A resistor is a passive two-terminal electrical component that implements electrical resistance as a circuit element. Resistors act to reduce current flow, and, at the same time, act to lower voltage levels within circuits. - Wikipedia; PROD_ID: RES-09334
R3 R7 = SparkFun-Resistors:10KOHM: 10kΩ resistor A resistor is a passive two-terminal electrical component that implements electrical resistance as a circuit element. Resistors act to reduce current flow, and, at the same time, act to lower voltage levels within circuits. - Wikipedia; PROD_ID: RES-00824
R5 R6 = SparkFun-Resistors:5.6KOHM: 5.6kΩ resistor A resistor is a passive two-terminal electrical component that implements electrical resistance as a circuit element. Resistors act to reduce current flow, and, at the same time, act to lower voltage levels within circuits. - Wikipedia; PROD_ID: RES-12378; VALUE: 5.6k
R8 R9 = SparkFun-Resistors:4.7KOHM: 4.7kΩ resistor A resistor is a passive two-terminal electrical component that implements electrical resistance as a circuit element. Resistors act to reduce current flow, and, at the same time, act to lower voltage levels within circuits. - Wikipedia; PROD_ID: RES-07857
R10 = SparkFun-Resistors:330OHM: 330Ω resistor A resistor is a passive two-terminal electrical component that implements electrical resistance as a circuit element. Resistors act to reduce current flow, and, at the same time, act to lower voltage levels within circuits. - Wikipedia; PROD_ID: RES-00818
R11-R14 = SparkFun-Resistors:1KOHM: 1kΩ resistor A resistor is a passive two-terminal electrical component that implements electrical resistance as a circuit element. Resistors act to reduce current flow, and, at the same time, act to lower voltage levels within circuits. - Wikipedia; PROD_ID: RES-07856
R15-R18 = SparkFun-Resistors:100OHM: 100Ω resistor A resistor is a passive two-terminal electrical component that implements electrical resistance as a circuit element. Resistors act to reduce current flow, and, at the same time, act to lower voltage levels within circuits. - Wikipedia; PROD_ID: RES-12438
S1 S2 = SparkFun-Switches:MOMENTARY-SWITCH-SPST: Momentary Switch (Pushbutton) - SPST Normally-open (NO) SPST momentary switches (buttons, pushbuttons). Variants PTH-12MM - 12mm square, through-hole Momentary Pushbutton Switch - 12mm Square <https://www.sparkfun.com/products/9190> (COM-09190) PTH-6.0MM, PTH-6.0MM-KIT - 6.0mm square, through-hole Mini Pushbutton Switch <https://www.sparkfun.com/products/97> (COM-00097) KIT package intended for soldering kit's - only one side of pads' copper is exposed. PTH-RIGHT-ANGLE-KIT - Right-angle, through-hole Right Angle Tactile Button <https://www.sparkfun.com/products/10791> - Used on SparkFun BigTime Watch Kit <https://www.sparkfun.com/products/11734> SMD-12MM - 12mm square, surface-mount Tactile Button - SMD (12mm) <https://www.sparkfun.com/products/12993> (COM-12993) Used on SparkFun PicoBoard <https://www.sparkfun.com/products/11888> SMD-4.5MM - 4.5mm Square Trackball Switch Used on SparkFun Blackberry Trackballer Breakout <https://www.sparkfun.com/products/13169> SMD-4.6MMX2.8MM - 4.60mm x 2.80mm, surface mount Used on SparkFun SAMD21 Mini Breakout <https://www.sparkfun.com/products/13664> SMD-5.2MM, SMD-5.2-REDUNDANT - 5.2mm square, surface-mount Mini Pushbutton Switch - SMD <https://www.sparkfun.com/products/8720> (COM-08720) Used on Arduino Pro Mini <https://www.sparkfun.com/products/11114> REDUNDANT package connects both switch circuits together SMD-6.0X3.5MM - 6.0 x 3.5mm, surface mount Momentary Reset Switch SMD <https://www.sparkfun.com/products/8229> (COM-08229) SMD-6.2MM-TALL - 6.2mm square, surface mount Tactile Button - SMD (6mm) <https://www.sparkfun.com/products/12992> Used on SparkFun Digital Sandbox <https://www.sparkfun.com/products/12651> SMD-RIGHT-ANGLE - Right-angle, surface mount Used on SparkFun Block for Intel® Edison - Arduino <https://www.sparkfun.com/products/13036>; PROD_ID: SWCH-00815; SF_SKU: COM-08229
U1 = RP2040:RP2040: Check availability <https://pricing.snapeda.com/parts/RP2040/Raspberry%20Pi/view-part?ref=eda>; AVAILABILITY: In Stock; DESCRIPTION: RP2040 chip for Raspberry Pi Pico - ARM® Cortex®-M0+ MCU 32-Bit; MF: Raspberry Pi; MP: RP2040; PACKAGE: None; PRICE: None; PURCHASE-URL: https://pricing.snapeda.com/search/part/RP2040/?ref=eda
U2 = W25Q512JVEIM:W25Q512JVEIM: Check availability <https://pricing.snapeda.com/parts/W25Q512JVEIM/Winbond%20Electronics/view-part?ref=eda>; AVAILABILITY: In Stock; DESCRIPTION: FLASH - NOR Memory IC 512Mb (64M x 8) SPI - Quad I/O 133 MHz 8-WSON (8x6); MF: Winbond Electronics; MP: W25Q512JVEIM; PACKAGE: WDFN-8 Winbond Electronics; PRICE: None; PURCHASE-URL: https://pricing.snapeda.com/search/part/W25Q512JVEIM/?ref=eda
U3 = LP3961EMP-3.3:LP3961EMP-3.3: Dropout Linear Regulator; DESCRIPTION: 800-mA, high-accuracy, low-dropout voltage regulator with enable; DIGI-KEY_PART_NUMBER: LP3961EMP-3.3/NOPBTR-ND; MF: Texas Instruments; MP: LP3961EMP-3.3/NOPB; PACKAGE: SOT-223-5 Texas Instruments; PURCHASE-URL: https://pricing.snapeda.com/search/part/LP3961EMP-3.3/NOPB/?ref=eda
U4 = BME688:BME688: Gas sensor measuring relative humidity, barometric pressure, ambient temperature and gas (VOC) Check availability <https://pricing.snapeda.com/parts/BME688/Bosch%20Sensortec/view-part?ref=eda>; AVAILABILITY: In Stock; DESCRIPTION: Gas sensor measuring relative humidity, barometric pressure, ambient temperature and gas (VOC); MF: Bosch Sensortec; MP: BME688; PACKAGE: None; PRICE: None; PURCHASE-URL: https://pricing.snapeda.com/search/part/BME688/?ref=eda
U5 = BMI270:BMI270: IMU ACCEL/GYRO I2C/SPI 14LGA Check availability <https://pricing.snapeda.com/parts/BMI270/Bosch%20Sensortec/view-part?ref=eda>; AVAILABILITY: In Stock; DESCRIPTION: Accelerometer, Gyroscope, 6 Axis Sensor I²C, SPI Output; MF: Bosch Sensortec; MP: BMI270; PACKAGE: LGA-14 Bosch Sensortec; PRICE: None; PURCHASE-URL: https://pricing.snapeda.com/search/part/BMI270/?ref=eda
U$1 = TC78H651AFNG:TC78H651AFNG: Check availability <https://pricing.snapeda.com/parts/TC78H651AFNG/Toshiba/view-part?ref=eda>; AVAILABILITY: In Stock; DESCRIPTION: Dual Full Bridge Motor Driver 3V 16-Pin TSSOP T/R; MF: Toshiba; MP: TC78H651AFNG; PACKAGE: None; PRICE: None; PURCHASE-URL: https://pricing.snapeda.com/search/part/TC78H651AFNG/?ref=eda
Y1 = ABLS-12.000MHZ-B4-T:ABLS-12.000MHZ-B4-T: Check availability <https://pricing.snapeda.com/parts/ABLS-12.000MHZ-B4-T/Abracon%20LLC/view-part?ref=eda>; AVAILABILITY: In Stock; DESCRIPTION: HC/49US (AT49) SMD LOW PROFILE CRYSTAL; MF: Abracon LLC; MP: ABLS-12.000MHZ-B4-T; PACKAGE: HC-49/US Abracon LLC; PRICE: None; PURCHASE-URL: https://pricing.snapeda.com/search/part/ABLS-12.000MHZ-B4-T/?ref=eda

## Board
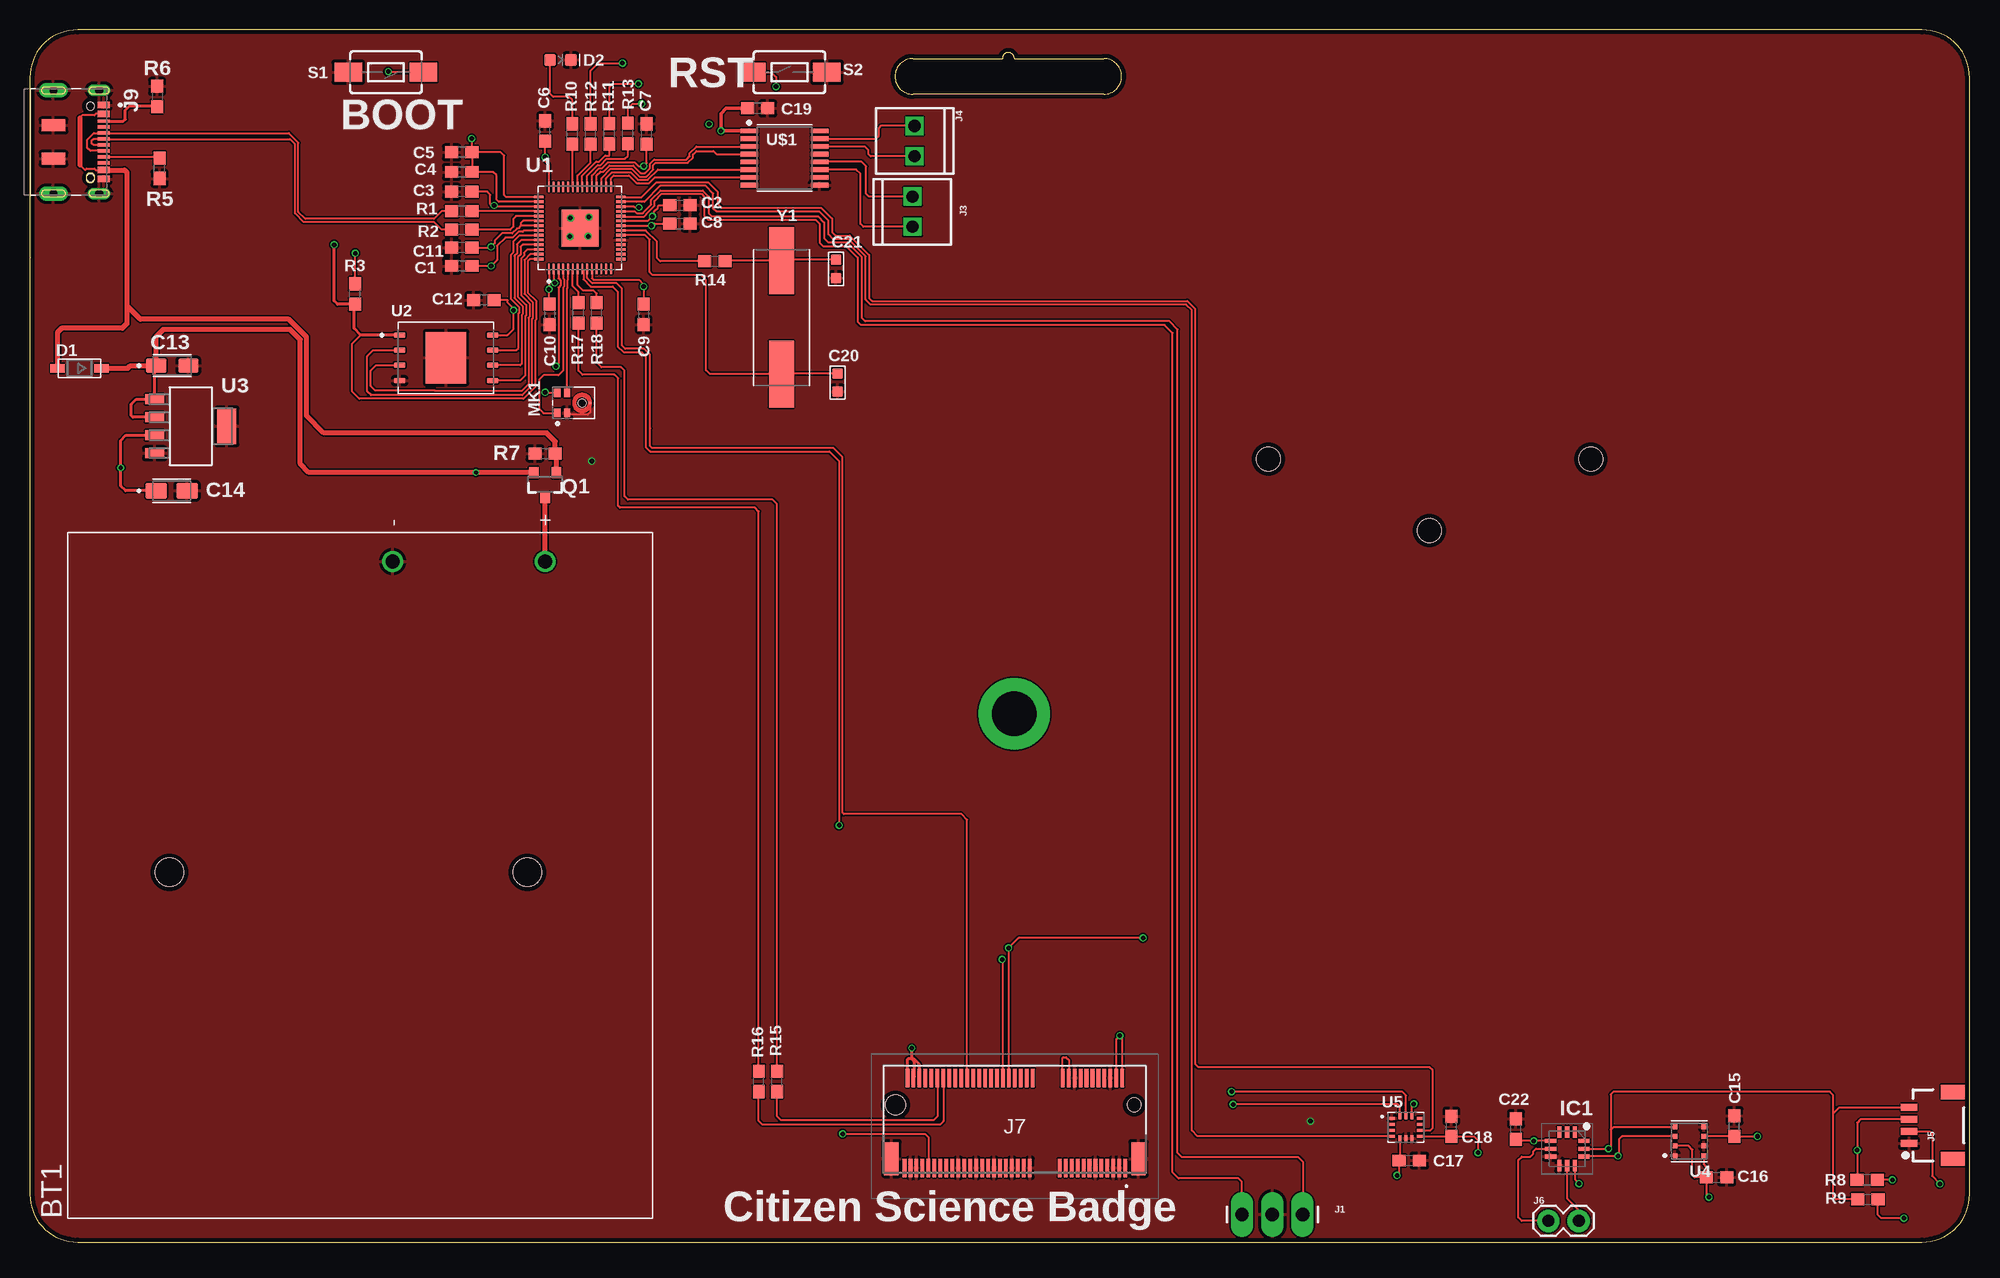
[diagram p5: board, top side]
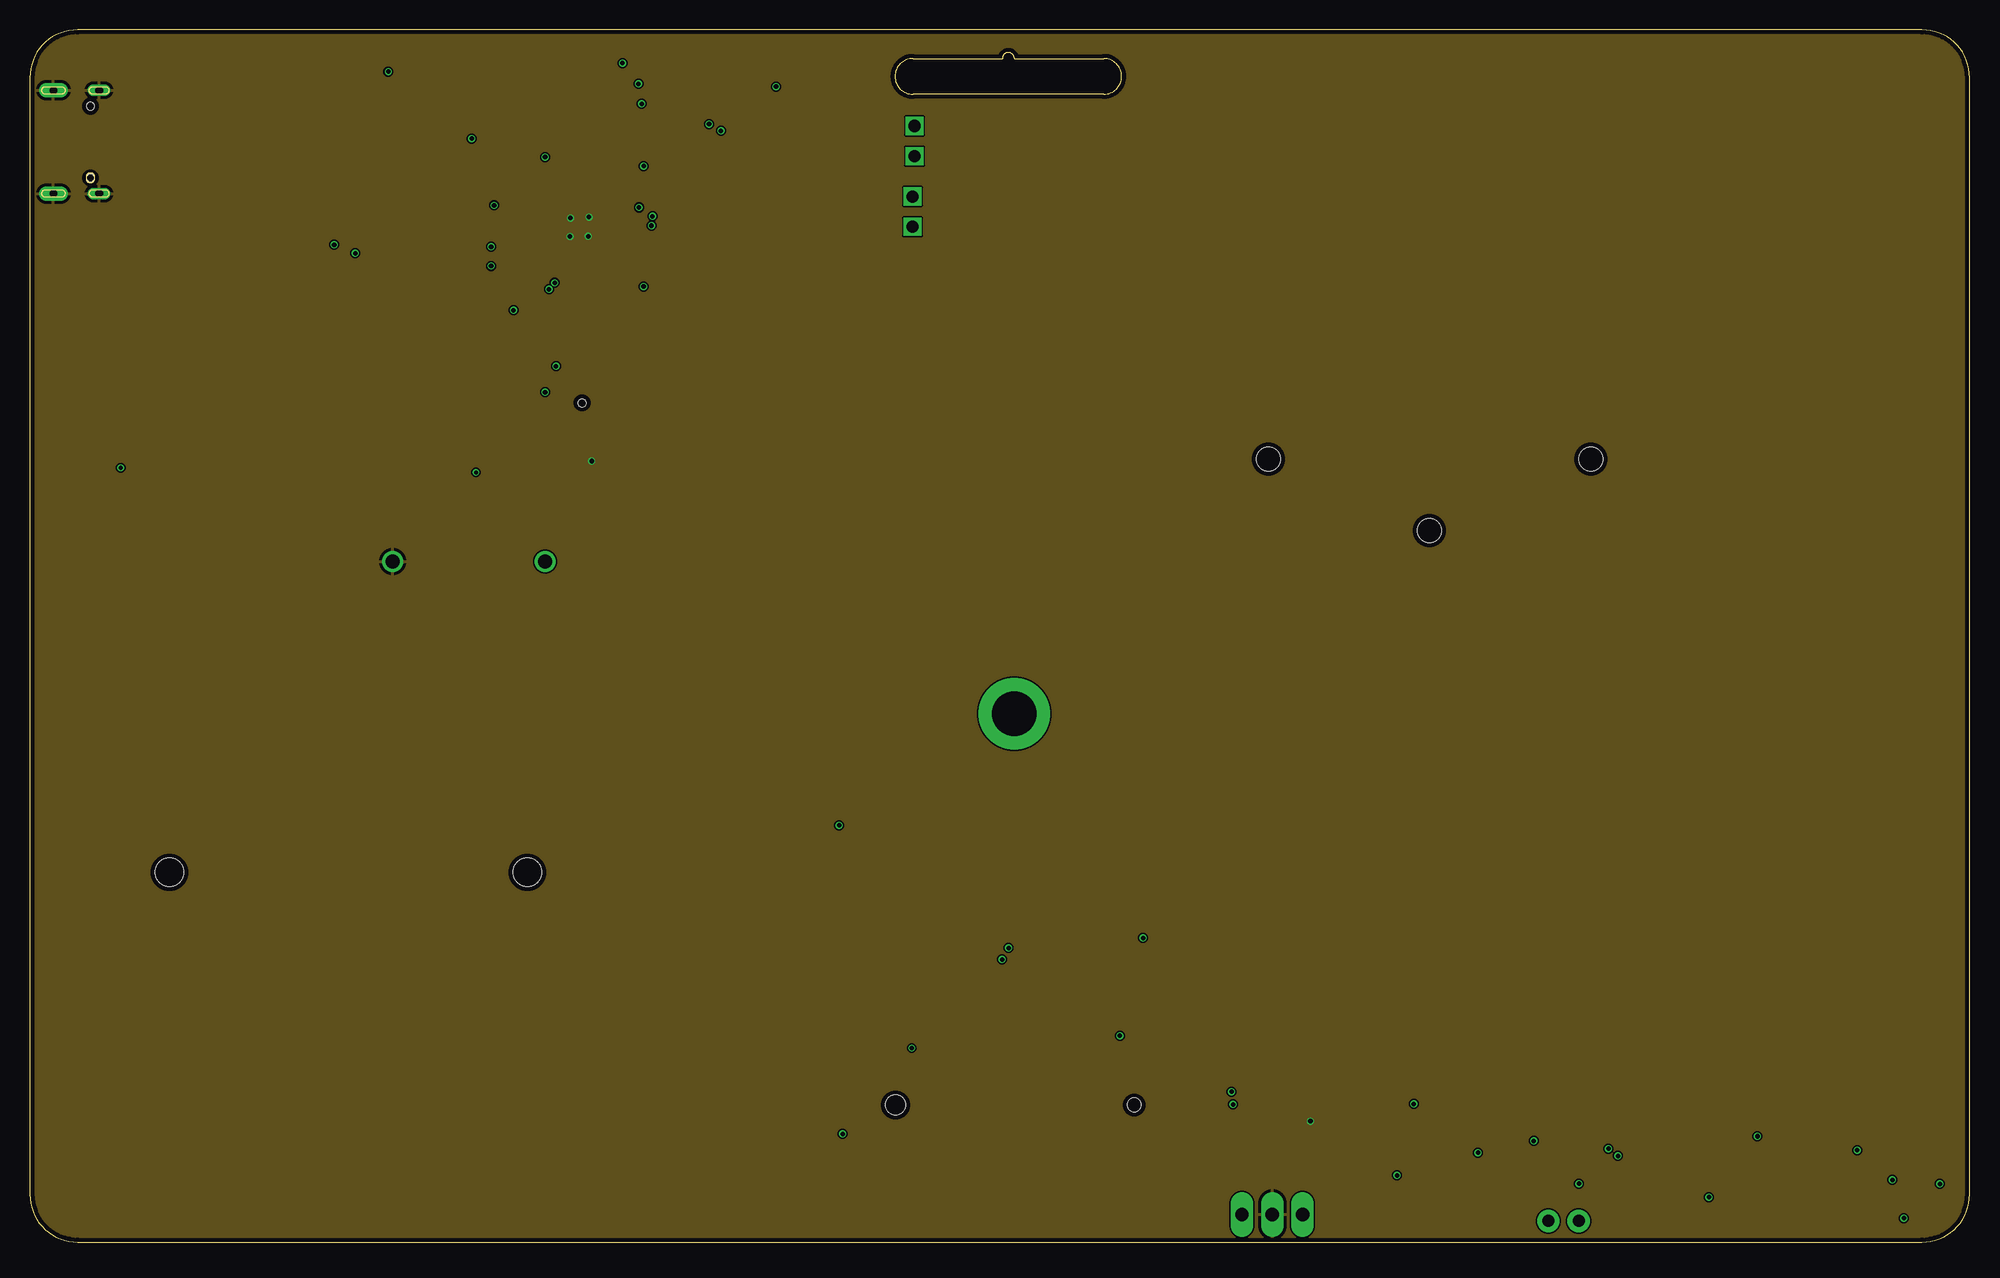
[diagram p6: board, inner layer Route2]
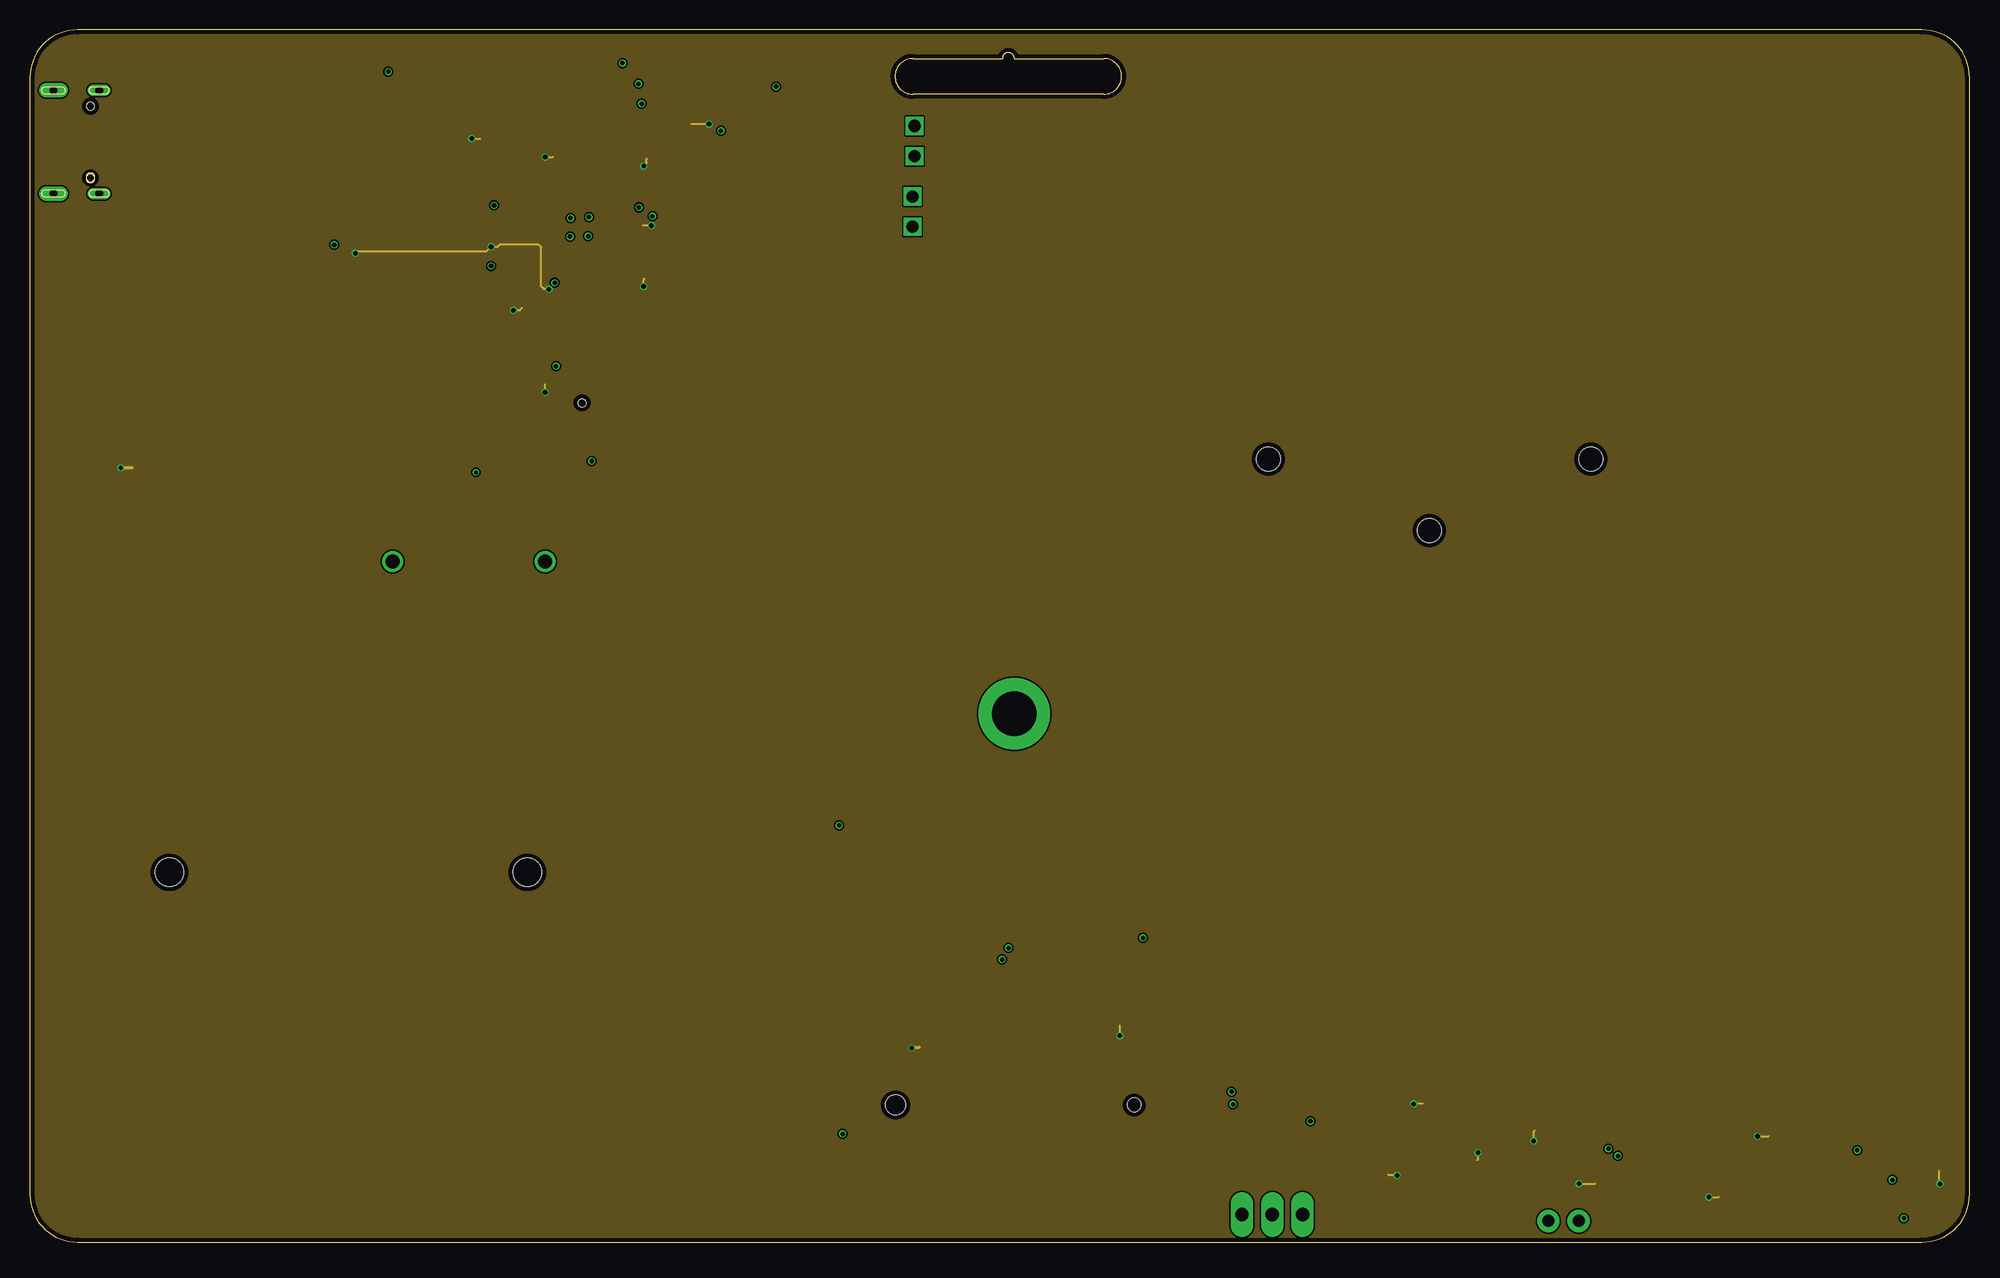
[diagram p7: board, inner layer Route15]
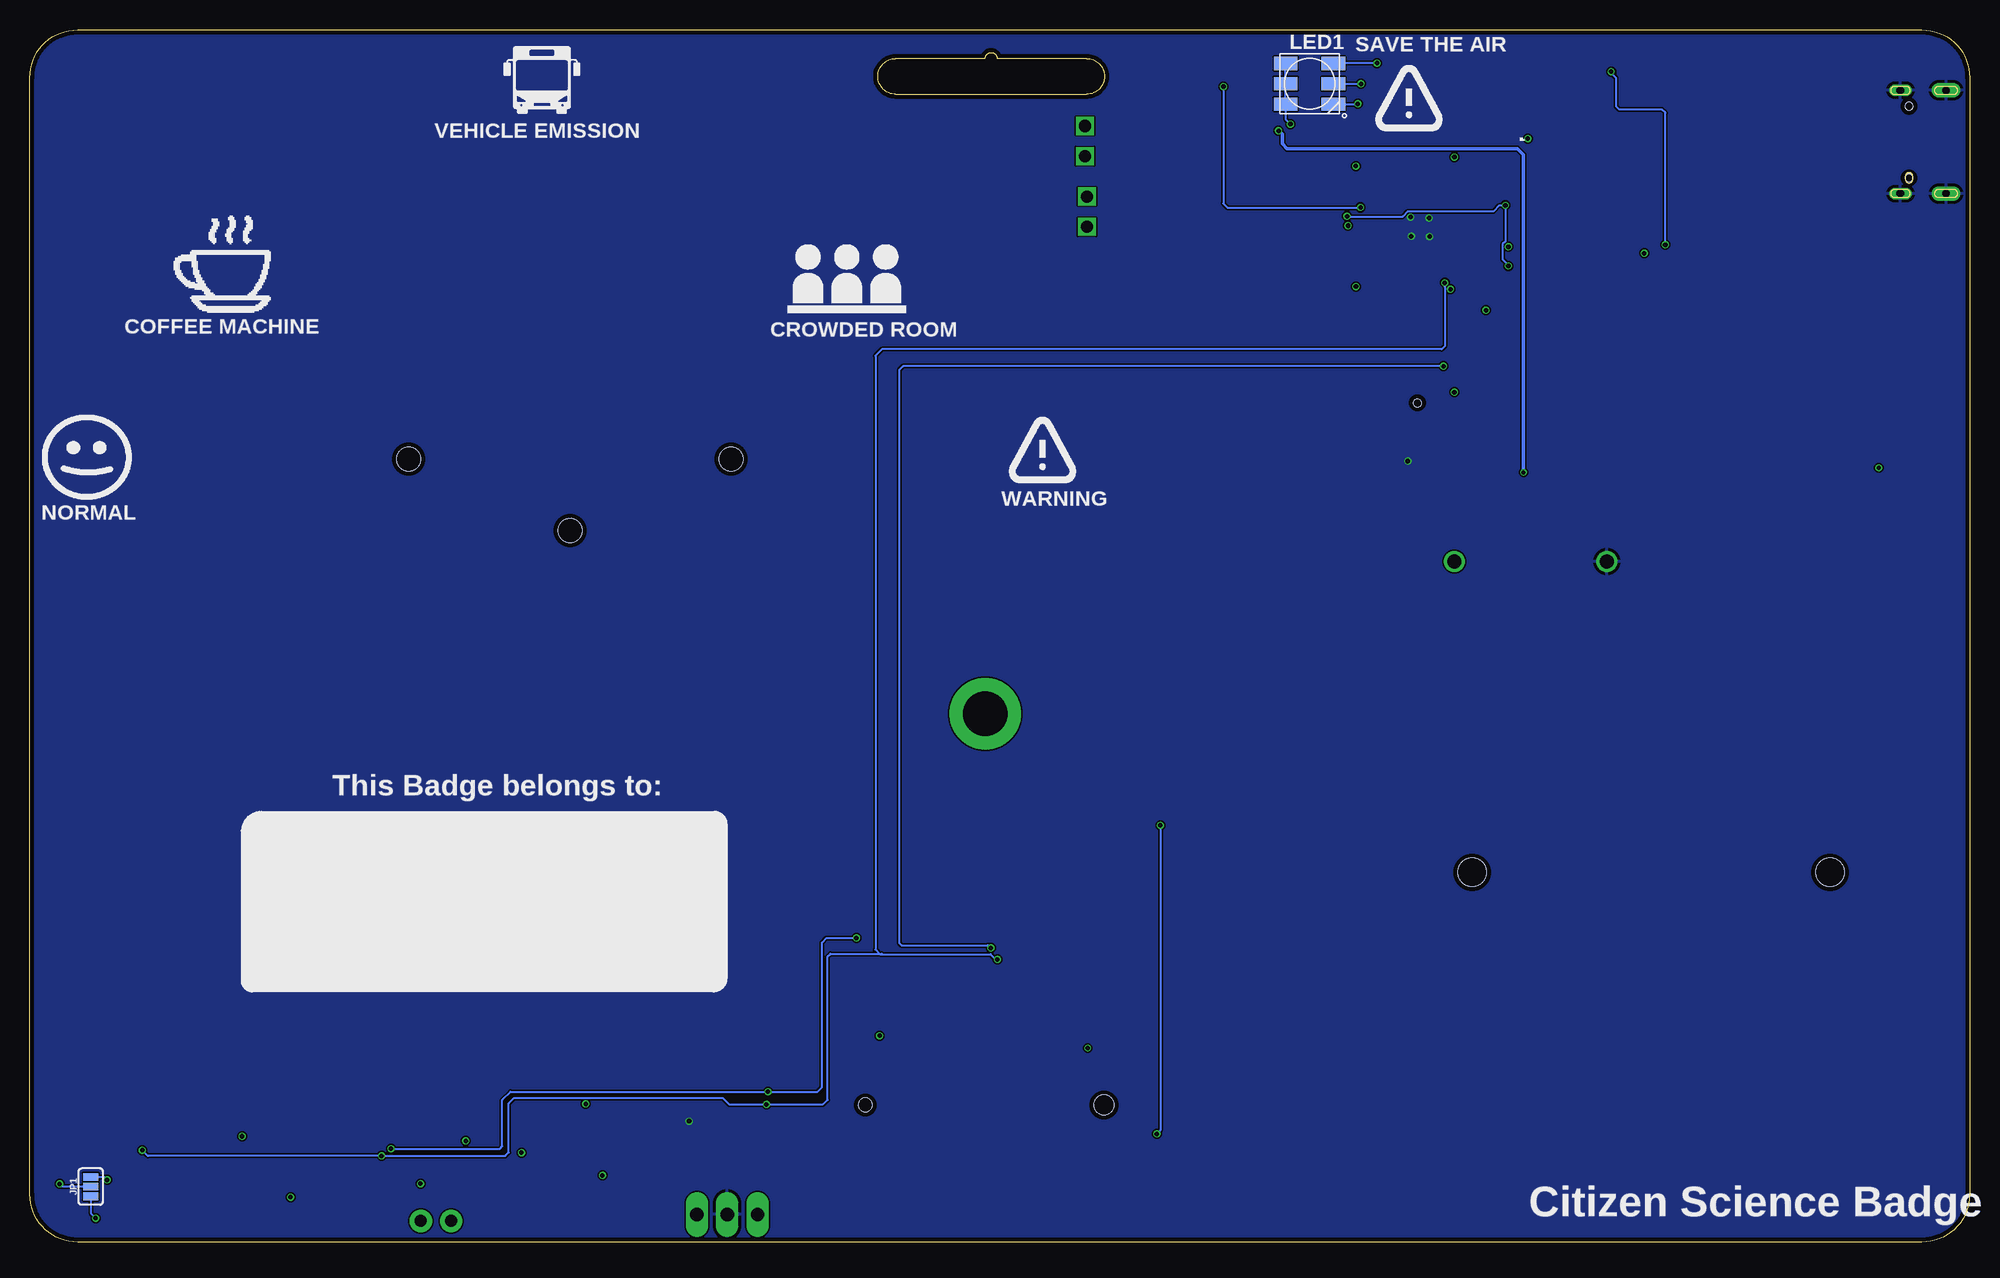
[diagram p8: board, bottom side, seen from below]

Size 162.56 x 101.6 mm. Coordinates in mm from the lower left corner, seen from the top.
Outline: 90,96.2 arc180 90,99.2 82.5,99.2 arc180 81.5,99.2 74,99.2 arc180 74,96.2 90,96.2
Outline: 158.56,0 arc90 162.56,4 162.56,97.6 arc90 158.56,101.6 4,101.6 arc90 0,97.6 0,4 arc90 4,0 158.56,0
Copper layers (1+2*15+16): Top 0.035559375mm / dielectric 0.17018125mm / Route2 0.01778125mm / dielectric 47mil / Route15 0.01778125mm / dielectric 0.17018125mm / Bottom 0.035559375mm
Design rules "oshpark-4layer *": minimum track width 5mil, minimum drill 10mil, track to track 5mil, track to pad 5mil, pad to pad 5mil, via to via 5mil, smd to smd 5mil, copper to edge 15mil, drill to drill 6mil, minimum pad ring 4mil, minimum via ring 4mil, stop-mask expansion 1.5mil, vias tented up to drill 0mil, thermal gap 10mil
Holes 2 mm at 117.3,59.62 103.8,65.62 130.8,65.62

### Footprints (pad centres in the part's own frame; a part is rotated, then mirrored left to right if it is on the bottom)
BAT_BC3AAPC = drill 1.17: + 26.32,-15.5; - 26.32,-2.7 | hole 2.37: 0.25,-14; 0.25,16
0603 = smd 1.1 x 1: 1 -0.85,0; 2 0.85,0
CAPMP3216X180N = smd 1.71 x 1.23: 1 -1.35,0; 2 1.35,0
CAPMP3216X180N' = smd 1.81 x 1.32: 1 -1.3,0; 2 1.3,0
C0603 = smd 0.889 x 0.889: 1 0,0.762; 2 0,-0.762
SOD-123 = smd 1.2 x 0.7: A 1.85,0; C -1.85,0
LED-0603 = smd 1 x 1: A -0.877,0; C 0.877,0
QFN65P300X300X84-12N = smd 0.95 x 0.35: 1 -1.4,0.65; 2 -1.4,0; 3 -1.4,-0.65; 7 1.4,-0.65; 8 1.4,0; 9 1.4,0.65 | smd 0.35 x 0.95: 4 -0.65,-1.4; 5 0,-1.4; 6 0.65,-1.4; 10 0.65,1.4; 11 0,1.4; 12 -0.65,1.4
1X03_LONGPADS = drill 1.118 pad 1.88 long: 1 0,0; 2 2.54,0; 3 5.08,0
1X02_2.54_SCREWTERM = drill 1.016 square: P1 2.54,0; P2 0,0
1X04_1MM_RA = smd 0.6 x 1.35: 1 -1.5,0; 2 -0.5,0; 3 0.5,0; 4 1.5,0 | smd 1.2 x 2: NC1 2.8,-3.675; NC2 -2.8,-3.675
1X02 = drill 1.016 pad 1.88: 1 0,0; 2 2.54,0
NOTECARD = smd 0.3 x 1.55: 1 -9.25,4.075; 2 -9,-3.475; 3 -8.75,4.075; 4 -8.5,-3.475; 5 -8.25,4.075; 6 -8,-3.475; 7 -7.75,4.075; 8 -7.5,-3.475; 9 -7.25,4.075; 10 -7,-3.475; 11 -6.75,4.075; 12 -6.5,-3.475; 13 -6.25,4.075; 14 -6,-3.475; 15 -5.75,4.075; 16 -5.5,-3.475; 17 -5.25,4.075; 18 -5,-3.475; 19 -4.75,4.075; 20 -4.5,-3.475; 21 -4.25,4.075; 22 -4,-3.475; 23 -3.75,4.075; 32 -1.5,-3.475; 33 -1.25,4.075; 34 -1,-3.475; 35 -0.75,4.075; 36 -0.5,-3.475; 37 -0.25,4.075; 38 0,-3.475; 39 0.25,4.075; 40 0.5,-3.475; 41 0.75,4.075; 42 1,-3.475; 43 1.25,4.075; 44 1.5,-3.475; 45 1.75,4.075; 46 2,-3.475; 47 2.25,4.075; 48 2.5,-3.475; 49 2.75,4.075; 50 3,-3.475; 51 3.25,4.075; 52 3.5,-3.475; 53 3.75,4.075; 54 4,-3.475; 55 4.25,4.075; 56 4.5,-3.475; 57 4.75,4.075; 58 5,-3.475; 59 5.25,4.075; 60 5.5,-3.475; 61 5.75,4.075; 62 6,-3.475; 63 6.25,4.075; 64 6.5,-3.475; 65 6.75,4.075; 66 7,-3.475; 67 7.25,4.075; 68 7.5,-3.475; 69 7.75,4.075; 70 8,-3.475; 71 8.25,4.075; 72 8.5,-3.475; 73 8.75,4.075; 74 9,-3.475; 75 9.25,4.075 | smd 1.2 x 2.75: MP1 -10.35,3.3; MP2 10.35,3.3 | drill 3.7 pad 6: P$1 0.05,-34 | hole 1.15: -10,-1.2 | hole 1.65: 10,-1.2
JAE_DX07S016JA1R1500 = smd 0.52 x 1: 1 -3.1,1.1; 2 -2.35,1.1; 11 2.35,1.1; 12 3.1,1.1 | smd 0.27 x 1: 3 -1.75,1.1; 4 -1.25,1.1; 5 -0.75,1.1; 6 -0.25,1.1; 7 0.25,1.1; 8 0.75,1.1; 9 1.25,1.1; 10 1.75,1.1 | smd 1 x 2: S1 -1.4,-3.1; S2 1.4,-3.1 | drill 0.65 long: S3 -4.32,0.725; S4 4.32,0.725 | drill 0.65 pad 1.2 long: S5 -4.32,-3.1; S6 4.32,-3.1 | hole 0.6: 3,0 | hole 0.63: 3,0; -3,0
SMT-JUMPER_3_NO_SILK = smd 0.635 x 1.27: 1 -0.813,0; 2 0,0; 3 0.813,0
RGBLED5050 = smd 2 x 1.1: 1 -2,1.7; 2 -2,0; 3 -2,-1.7; 4 2,-1.7; 5 2,0; 6 2,1.7
MIC_ICS-41350 = smd 0.725 x 0.522: 1 -0.838,1.361; 2 -0.838,0.539; 4 0.838,0.539; 5 0.838,1.361 | smd 0.2 x 0.2: 3 -0.015,-1.383 | hole 0.65: 0,-0.713
SOT23-3 = smd 0.8 x 0.9: 1 -0.95,-1; 2 0.95,-1; 3 0,1.1
TACTILE_SWITCH_SMD_6.0X3.5MM = smd 2.3 x 1.6: 1 -3.15,0; 2 3.15,0
QFN40P700X700X90-57N = smd 0.84 x 0.2: 1 -3.435,2.6; 2 -3.435,2.2; 3 -3.435,1.8; 4 -3.435,1.4; 5 -3.435,1; 6 -3.435,0.6; 7 -3.435,0.2; 8 -3.435,-0.2; 9 -3.435,-0.6; 10 -3.435,-1; 11 -3.435,-1.4; 12 -3.435,-1.8; 13 -3.435,-2.2; 14 -3.435,-2.6; 29 3.435,-2.6; 30 3.435,-2.2; 31 3.435,-1.8; 32 3.435,-1.4; 33 3.435,-1; 34 3.435,-0.6; 35 3.435,-0.2; 36 3.435,0.2; 37 3.435,0.6; 38 3.435,1; 39 3.435,1.4; 40 3.435,1.8; 41 3.435,2.2; 42 3.435,2.6 | smd 0.2 x 0.84: 15 -2.6,-3.435; 16 -2.2,-3.435; 17 -1.8,-3.435; 18 -1.4,-3.435; 19 -1,-3.435; 20 -0.6,-3.435; 21 -0.2,-3.435; 22 0.2,-3.435; 23 0.6,-3.435; 24 1,-3.435; 25 1.4,-3.435; 26 1.8,-3.435; 27 2.2,-3.435; 28 2.6,-3.435; 43 2.6,3.435; 44 2.2,3.435; 45 1.8,3.435; 46 1.4,3.435; 47 1,3.435; 48 0.6,3.435; 49 0.2,3.435; 50 -0.2,3.435; 51 -0.6,3.435; 52 -1,3.435; 53 -1.4,3.435; 54 -1.8,3.435; 55 -2.2,3.435; 56 -2.6,3.435 | smd 3.1 x 3.1: 57 0,0
SON127P600X800X80-9N = smd 0.94 x 0.44: 1 -3.895,1.905; 2 -3.895,0.635; 3 -3.895,-0.635; 4 -3.895,-1.905; 5 3.895,-1.905; 6 3.895,-0.635; 7 3.895,0.635; 8 3.895,1.905 | smd 3.4 x 4.3: 9 0,0
SOT150P696X180-5N = smd 1.6 x 0.838: 1 -3.023,2.261; 2 -3.023,0.762; 3 -3.023,-0.762; 4 -3.023,-2.261 | smd 1.6 x 2.997: 5 3.023,0
IC_BME688 = smd 0.4 x 0.4: 1 1.2,1.2; 2 1.2,0.4; 3 1.2,-0.4; 4 1.2,-1.2; 5 -1.2,-1.2; 6 -1.2,-0.4; 7 -1.2,0.4; 8 -1.2,1.2
XDCR_BMI270 = smd 0.475 x 0.25: 1 -1.163,0.75; 2 -1.163,0.25; 3 -1.163,-0.25; 4 -1.163,-0.75; 8 1.163,-0.75; 9 1.163,-0.25; 10 1.163,0.25; 11 1.163,0.75 | smd 0.25 x 0.475: 5 -0.5,-0.912; 6 0,-0.912; 7 0.5,-0.912; 12 0.5,0.912; 13 0,0.912; 14 -0.5,0.912
P-TSSOP16-0505-0.65-001 = smd 1.462 x 0.391: 1 -2.935,2.275; 2 -2.935,1.625; 3 -2.935,0.975; 4 -2.935,0.325; 5 -2.935,-0.325; 6 -2.935,-0.975; 7 -2.935,-1.625; 8 -2.935,-2.275; 9 2.935,-2.275; 10 2.935,-1.625; 11 2.935,-0.975; 12 2.935,-0.325; 13 2.935,0.325; 14 2.935,0.975; 15 2.935,1.625; 16 2.935,2.275
XTAL_ABLS-12.000MHZ-B4-T = smd 5.6 x 2.1: 1 -4.75,0; 2 4.75,0

### Placement (x,y rotation side)
BT1  27.69,30.73 90 top
C1  36.2,81.81 180 top
C2  54.48,86.89 0 top
C3  36.2,88.04 180 top
C4  36.2,89.69 180 top
C5  36.2,91.34 180 top
C6  43.18,93.12 90 top
C7  51.69,92.86 90 top
C8  54.48,85.37 0 top
C9  51.44,77.75 270 top
C10  43.56,77.75 270 top
C11  36.2,83.34 180 top
C12  38.05,78.94 180 top
C13  11.94,73.46 0 top
C14  33uF  [CAPMP3216X180N']  11.89,62.97 0 top
C15  142.85,9.73 90 top
C16  141.35,5.41 0 top
C17  115.6,6.83 0 top
C18  119.13,9.7 90 top
C19  60.99,95.02 180 top
C20  67.69,72.03 0 top
C21  67.56,81.56 0 top
C22  124.54,9.47 90 top
D1  4.17,73.23 180 top
D2  44.48,99.09 0 top
IC1  128.83,7.82 270 top
J1  101.57,2.31 0 top
J3  73.96,85.09 90 top
J4  74.14,93.55 270 top
J5  157.48,9.78 90 top
J6  127.25,1.78 0 top
J7  82.55,10.29 180 top
J9  5.08,92.2 270 top
JP1  157.45,4.65 90 bottom
LED1  55.32,97.08 0 bottom
MK1  45.57,70.33 90 top
Q1  43.18,63.5 180 top
R1  36.2,86.39 180 top
R2  36.2,84.86 180 top
R3  27.25,79.45 90 top
R5  10.87,89.99 90 top
R6  10.67,96.01 270 top
R7  43.18,66.09 0 top
R8  153.97,5.23 0 top
R9  154.03,3.58 0 top
R10  45.47,92.86 90 top
R11  48.56,92.89 90 top
R12  46.99,92.86 90 top
R13  50.11,92.91 90 top
R14  57.4,82.19 0 top
R15  62.61,13.46 90 top
R16  61.09,13.46 90 top
R17  45.97,77.88 90 top
R18  47.5,77.88 90 top
S1  29.84,98.04 180 top
S2  63.65,98.04 0 top
U1  46.1,84.99 90 top
U2  34.87,74.12 0 top
U3  13.49,68.38 0 top
U4  139.06,8.46 180 top
U5  115.32,9.63 0 top
U$1  63.25,90.86 0 top
Y1  62.99,77.5 270 top

### Tracks (layer width: path | path; a pad name or v marks a point on that pad's centre or on a via)
3.3V  (via drill 0.35, 0.38)
  Top 0.152: U1.48 41.34,85.59 41.15,85.39 41.15,85.19 | C11.1 37.07,83.31 38.56,83.31 v38.66,83.41 38.96,83.72 38.96,83.95 39.57,84.56 40.43,84.56 40.83,84.95 40.9,84.95 41.15,85.19 | U1.49 41.15,85.19 | U1.44 39.3,87.19 39.12,87.38 39.12,89.41 38.84,89.69 37.08,89.69 | 37.08,89.69 C4.1 | U1.43 39.92,87.59 39.75,87.76 39.75,91.06 39.47,91.34 C5.1 | C5.1 37.05,89.73 37.08,89.69 | C5.1 37.05,92.47 v37.03,92.48 | U1.42 43.5,90.28 43.18,90.6 v43.18,90.93 C6.1 | C10.1 43.5,78.66 v43.5,79.86 43.5,80.18 43.5,80.19 43.5,80.6 U1.1 | U1.22 v52.09,85.19 52.17,85.19 52.35,85.37 C8.1 | U1.10 47.1,80.79 47.24,80.64 51.05,80.64 51.44,80.26 v51.44,80.09 C9.1 | MK1.5 43.23,71.17 v43.18,71.22 | R3.2 27.25,82.86 v27.28,82.88 | U1.33 47.1,89.39 47.7,89.99 47.95,89.99 48.46,90.5 50.68,90.5 51,90.18 v51.45,90.18 51.69,90.42 C7.1 | U2.8 40.03,76.02 40.54,76.53 v40.54,78.11 40.54,78.25 40.06,78.73 40.06,78.92 40.03,78.94 C12.1 | J7.4 91.05,17.01 v91.34,17.3 91.55,17.09 J7.2 | IC1.4 126.05,8.47 v126.03,8.48 124.68,8.48 C22.1 | IC1.9 129.48,5.24 v129.82,4.9 | U5.5 114.82,6.9 C17.1 114.75,5.75 v114.58,5.59 | U5.8 119.1,8.88 C18.1 121.02,8.85 121.36,8.51 v121.36,7.49 | U5.12 115.82,11.42 v115.98,11.58 | U4.8 140.26,6.55 140.5,6.31 C16.1 | C16.1 139.5,5.41 139.32,5.59 139.32,7.75 139.01,8.06 U4.2 | U4.6 142.83,8.86 C15.1 144.77,8.88 v144.78,8.87 | J5.2 159.2,9.28 159.41,9.07 159.41,5.54 v160.07,4.88 | C16.1 140.5,3.95 140.69,3.76 v140.72,3.76
  Top 0.254: 11.05,67.61 U3.3 8.05,67.61 7.62,67.18 v7.62,64.9 7.62,63.37 8.03,62.97 C14.1 | J7.74 73.55,15.31 73.64,15.39 74.04,15.39 74.09,15.34 | 74.09,15.34 74.09,15.14 | 74.09,15.14 74.09,13.8 J7.72 | J7.70 74.55,14.88 74.09,15.34 | 74.09,15.14 73.91,15.32 v73.91,16.26
  Route15 0.152: v37.03,92.48 37.72,92.48 37.74,92.46 | v43.5,79.86 43.08,79.86 42.85,80.09 42.85,83.39 42.65,83.59 39.4,83.59 39.22,83.41 v38.66,83.41 38.28,83.03 27.43,83.03 v27.28,82.88 | v52.09,85.19 51.36,85.19 | v43.18,71.22 43.18,71.88 | v51.45,90.18 51.69,90.42 51.69,90.78 | v43.18,90.93 43.81,90.93 | v51.44,80.09 51.44,80.67 51.51,80.75 | v40.54,78.11 41.05,78.11 41.22,78.28 | v91.34,17.3 91.34,18.16 | v56.92,93.7 55.42,93.7 | v114.58,5.59 113.89,5.59 113.84,5.64 | v121.36,7.49 121.36,6.93 121.28,6.86 | v126.03,8.48 126.03,9.27 126.11,9.35 | v115.98,11.58 116,11.61 116.74,11.61 | v160.07,4.88 160,4.95 160,5.94 | v140.72,3.76 141.5,3.76 141.53,3.73 | v144.78,8.87 145.72,8.87 | v129.82,4.9 131.19,4.9
  Route15 0.254: v7.62,64.9 8.56,64.9 8.59,64.87 | v73.91,16.26 73.99,16.33 74.52,16.33
  Bottom 0.152: LED1.2 LED1.3 57.32,94.1 v56.92,93.7 | LED1.2 LED1.1 | LED1.2 57.37,97.13 | JP1.2 159.84,4.65 v160.07,4.88
  pour Route15: -7.62,-8.89 -7.62,100.33 3.81,111.76 161.29,111.76 177.8,95.25 177.8,7.62 168.91,-1.27 161.29,-8.89
!RESET  (via drill 0.38)
  Top 0.152: S2.1 62.13,98.04 62.53,97.64 v62.53,96.85 | v51.05,86.72 50.7,86.72 50.63,86.79 U1.26
  Bottom 0.152: v62.53,96.85 62.53,87.05 62.2,86.72 v51.05,86.72
ATTN
  Top 0.152: J7.54 78.55,35.39 78.08,35.87 68.22,35.87 68.1,35.99 68.1,65.79 67.33,66.55 52.15,66.55 51.99,66.7 51.99,68.2 51.97,68.22 51.97,74.37 51.46,74.88 49.89,74.88 49.63,75.13 49.63,79.91 49.17,80.37 47.13,80.37 46.7,80.79 U1.9
B
  Top 0.152: U1.34 46.7,89.39 47.59,90.27 47.83,90.27 48.34,90.78 49.83,90.78 50.11,91.06 R13.1
CLK
  Top 0.152: U1.5 45.1,80.66 45.05,80.61 45.05,79.95 45.03,79.94 MK1.4
DATA
  Top 0.152: MK1.1 44.18,69.47 43.05,69.47 42.69,69.84 42.69,72.28 43.05,72.64 44.3,72.64 44.7,73.05 44.7,80 44.77,80.07 44.77,80.71 44.7,80.78 U1.4
G
  Top 0.152: R12.1 46.99,90.47 45.9,89.38 U1.36
GND  (via drill 0.38)
  Top 0.152: MK1.3 46.95,69.53 46.76,69.34 45.18,69.34 MK1.2
  other vias: 45.31,85.83 46.86,85.9 45.26,84.28 46.79,84.3 107.31,10.13 47.09,65.46
  pour Top: -15.24,-12.7 208.28,-12.7 208.28,118.11 204.47,121.92 -2.54,121.92 -15.24,109.22
  pour Bottom: -19.05,-24.13 212.09,-24.13 220.98,-15.24 220.98,119.38 212.09,128.27 -13.97,128.27 -27.94,114.3 -27.94,-15.24
  pour Route2: -19.05,-11.43 -19.05,115.57 -11.43,123.19 208.28,123.19 215.9,115.57 214.63,114.3 214.63,-15.24 -15.24,-15.24
IN1
  Top 0.152: U$1.6 52.64,89.88 51.78,89.03 50.97,89.03 50.33,89.66 48.8,89.66 48.3,89.16 U1.30
IN2
  Top 0.152: U$1.7 52.38,89.23 51.9,88.75 51.03,88.75 50.85,88.75 50.22,89.38 48.92,89.38 48.7,89.16 U1.29
IN3
  Top 0.152: U$1.4 57.54,91.18 57.28,91.43 55.86,91.43 55.58,91.15 55.58,90.89 55.13,90.45 52.44,90.45 52.25,90.26 52.25,89.89 51.67,89.31 51.08,89.31 50.45,89.94 48.69,89.94 47.9,89.15 U1.31
IN4
  Top 0.152: U1.32 47.5,89.4 47.82,89.71 48.06,89.71 48.57,90.22 50.56,90.22 51.2,89.59 51.55,89.59 51.97,90 51.97,90.37 52.32,90.73 55.02,90.73 55.3,91.01 55.3,91.26 55.85,91.82 U$1.3
INT1
  Top 0.152: U5.4 97.85,8.88 97.38,9.35 97.38,78.09 96.89,78.59 70.47,78.59 70.05,79 70.05,82.61 68.59,84.07 67.31,84.07 66.93,84.45 66.93,85.6 66.17,86.36 57.53,86.36 57.28,86.61 57.28,87.88 56.64,88.52 52.83,88.52 51.5,87.19 51.28,87.19 51.26,87.21 50.85,87.21 50.83,87.19 U1.27
INT2
  Top 0.152: U1.28 51.27,87.59 52.5,88.82 56.84,88.82 57.63,88.04 57.63,87.02 57.96,86.69 66.32,86.69 67.23,85.78 67.23,84.66 67.54,84.35 68.71,84.35 70.33,82.73 70.33,79.12 70.59,78.87 97,78.87 97.66,78.21 97.66,14.91 97.92,14.66 117.3,14.66 117.58,14.38 117.58,9.58 117.38,9.38 U5.9
LED_R
  Top 0.152: U1.37 45.5,91.98 R10.1
N$1  (via drill 0.38)
  Top 0.152: v156.08,5.21 154.85,5.21 R8.2
  Bottom 0.152: JP1.3 156.34,5.46 v156.08,5.21
N$2  (via drill 0.38)
  Top 0.152: v157.05,2.01 155.14,2.01 154.86,2.29 154.86,3.57 R9.2
  Bottom 0.152: JP1.1 157.46,2.41 v157.05,2.01
N$3
  Top 0.152: J7.64 76.05,10.52 75.74,10.21 62.95,10.21 62.61,10.54 R15.1
N$4
  Top 0.152: J7.62 76.55,10.13 76.26,9.84 61.4,9.84 61.09,10.16 R16.1
N$5
  Top 0.406: BT1.+ Q1.3
N$6
  Top 0.152: J7.22 86.55,15.46 86.59,15.49 86.84,15.49 87.07,15.27 87.07,13.78 J7.20
N$7
  Top 0.152: R10.2 45.47,95.68 45.16,95.99 43.87,95.99 43.6,96.25 D2.A
N$9  (via drill 0.38)
  Top 0.152: R11.2 48.56,96.8 48.84,97.08 v51,97.08
  Bottom 0.152: LED1.5 v51,97.08
N$10  (via drill 0.38)
  Top 0.152: R12.2 46.99,98.17 47.62,98.81 v49.66,98.81
  Bottom 0.152: v49.66,98.81 53.29,98.81 LED1.6
N$11  (via drill 0.38)
  Top 0.152: R13.2 50.11,95.02 50.49,95.4 v51.28,95.4
  Bottom 0.152: LED1.4 51.31,95.38 v51.28,95.4
N$14
  Top 0.254: J9.3 7.85,93.95 8,94.11 8,94.87 8.38,95.25 10.58,95.25 R6.2
N$15
  Top 0.152: U1.6 45.5,80.1 45.97,79.63 R17.2
N$16
  Top 0.152: J9.9 10.76,90.95 R5.2
N$17
  Top 0.152: U1.7 45.9,80.21 46.35,79.76 47.24,79.76 47.5,79.5 R18.2
NRST  (via drill 0.38)
  Top 0.152: U1.8 46.4,81.46 46.4,80.7 47.01,80.09 48.84,80.09 49.28,79.65 49.28,75.06 49.76,74.57 51.26,74.57 51.61,74.22 51.61,66.65 51.99,66.27 67,66.27 67.82,65.46 v67.82,34.92 | v68.12,9.07 75.01,9.07 75.31,8.76 75.31,6.22 J7.67
  Bottom 0.152: v67.82,34.92 67.82,9.37 v68.12,9.07
OUT1
  Top 0.152: J3.P1 70.31,87.63 70.08,87.86 70.08,90.17 69.72,90.53 U$1.12
OUT2
  Top 0.152: J3.P2 69.85,85.09 69.6,85.34 69.6,89.53 69.25,89.88 U$1.11
OUT3
  Top 0.152: J4.P1 70.46,91.01 70.28,91.19 70.28,91.52 69.98,91.82 66.19,91.82 U$1.14
OUT4
  Top 0.152: U$1.15 70.89,92.48 71.14,92.73 71.14,93.37 71.37,93.6 74.09,93.6 J4.P2
OUTN
  Top 0.152: J6.2 129.79,2.67 128.83,3.63 IC1.8
OUTP
  Top 0.152: J6.1 125.02,1.78 124.74,2.06 124.74,6.88 125.02,7.16 125.73,7.16 125.98,7.42 125.98,7.59 126.21,7.82 IC1.5
QSPI_CS  (via drill 0.38)
  Top 0.152: U1.56 41.93,82.39 41.73,82.19 41.73,79.59 42.43,78.89 42.43,77.32 42.35,77.24 42.35,71.66 41.38,70.69 27.61,70.69 27.03,71.27 27.03,75.31 27.74,76.02 | v30.05,98.09 32.94,98.09 S1.1
  Top 0.254: U2.1 27.74,76.02 27.18,76.58 27.18,78.6 | R3.1 25.79,78.6 25.5,78.89 v25.5,83.59
  Top 0.406: R3.1 27.18,78.6
  Bottom 0.152: v25.5,83.59 25.5,94.64 25.78,94.92 29.36,94.92 29.62,95.17 29.62,97.56 30.1,98.04 v30.05,98.09
QSPI_SCLK
  Top 0.152: U1.52 41.19,83.99 40.82,83.62 40.82,82.86 40.62,82.66 40.62,79.12 41.31,78.43 41.31,77.78 41.23,77.7 41.23,73.61 41.1,73.48 U2.6
QSPI_SD0
  Top 0.152: U1.53 41.3,83.59 41.12,83.41 41.12,82.77 40.89,82.54 40.89,79.24 41.59,78.54 41.59,77.67 41.51,77.58 41.51,72.62 41.1,72.21 U2.5
QSPI_SD1
  Top 0.152: U2.2 28.78,74.75 28.27,74.24 28.27,71.3 28.6,70.97 41.26,70.97 42.07,71.77 42.07,77.35 42.15,77.44 42.15,78.77 41.45,79.47 41.45,82.31 41.93,82.79 U1.55
QSPI_SD2
  Top 0.152: U1.54 41.69,83.19 41.4,82.91 41.4,82.65 41.17,82.43 41.17,79.36 41.87,78.66 41.87,77.55 41.79,77.47 41.79,71.89 41.22,71.32 33.98,71.32 33.93,71.37 28.96,71.37 28.57,71.75 28.57,73.03 29.03,73.48 U2.3
QSPI_SD3
  Top 0.152: U2.7 40.77,74.75 40.95,74.94 40.95,77.82 41.03,77.9 41.03,78.31 40.34,79.01 40.34,82.77 40.54,82.98 40.54,83.87 41.06,84.39 U1.51
R
  Top 0.152: U1.35 46.3,89.38 47.47,90.55 47.72,90.55 48.23,91.06 48.56,91.06 48.56,91.07 R11.1
RX
  Top 0.152: R16.2 61.09,61.24 60.78,61.54 49.45,61.54 49.3,61.7 49.3,72.39 49,72.69 46.3,72.69 45.97,73.03 R17.1
SCL  (via drill 0.38)
  Top 0.152: v44.09,73.41 44.3,73.61 44.3,80 44.49,80.19 44.49,80.6 44.3,80.78 U1.3 | J7.40 82.02,13.79 v82.02,24.64 82.86,25.48 v93.29,25.48 | U5.13 115.32,12.29 115.01,12.6 v100.71,12.6 | R9.1 151.36,3.58 151.13,3.81 151.13,10.79 | J5.4 151.61,11.28 151.13,10.79 | IC1.11 v132.28,7.82 132.49,8.03 132.49,9.42 | U4.4 132.72,9.66 132.49,9.42 | 151.13,10.79 151.13,10.9 151.13,12.32 150.85,12.6 132.72,12.6 132.49,12.37 132.49,9.42
  Bottom 0.152: v44.09,73.41 89.38,73.41 89.71,73.08 89.71,25.07 89.51,24.87 82.27,24.87 82.04,24.64 v82.02,24.64 | v93.29,25.48 95.81,25.48 96.19,25.09 96.19,12.95 96.55,12.6 v100.71,12.6 122.28,12.6 122.96,11.91 122.96,8.03 123.17,7.82 v132.28,7.82
SDA  (via drill 0.38)
  Top 0.152: U1.2 43.9,80.48 v43.99,80.39 | J7.42 81.55,23.61 v81.48,23.67 | U5.14 114.82,11.35 114.63,11.53 v100.84,11.53 | J5.3 153.41,10.28 153.12,10 v153.12,7.7 R8.1 | U4.3 133.42,8.86 133.2,8.64 133.2,7.34 v133.08,7.23 133.03,7.17 IC1.10
  Bottom 0.152: v43.99,80.39 43.99,80.07 44,80.06 44,75.08 44.25,74.83 91.16,74.83 91.69,74.3 91.69,24.51 91.31,24.13 91.14,24.13 | 91.14,24.13 82.04,24.13 81.53,23.62 v81.48,23.67 | 91.14,24.13 91.16,24.16 95.48,24.16 95.71,23.93 95.71,11.91 96.09,11.53 v100.84,11.53 103.96,11.53 104.51,12.08 121.96,12.08 122.43,11.61 122.43,7.52 122.72,7.23 v133.08,7.23 152.67,7.23 153.14,7.7 v153.12,7.7
SWCLK
  Top 0.152: J1.1 101.58,5.05 101.3,5.33 96.27,5.33 95.76,5.84 95.76,76.2 95.1,76.86 69.65,76.86 69.37,77.14 69.37,82.51 68.39,83.49 66.47,83.49 66.19,83.77 66.19,85.34 65.86,85.67 56.84,85.67 56.52,86 56.52,87.62 56.27,87.86 52.96,87.86 52.35,87.25 52.35,86.84 51.68,86.18 51.68,86.15 51.48,85.94 49.58,85.94 U1.24
SWDIO
  Top 0.152: J1.3 106.68,2.34 106.68,6.73 106.3,7.11 96.55,7.11 96.19,7.47 96.19,76.48 95.5,77.17 70,77.17 69.7,77.47 69.7,82.57 68.48,83.8 66.9,83.8 66.57,84.12 66.57,85.45 66.04,85.98 57.15,85.98 56.9,86.23 56.9,87.63 56.39,88.14 52.85,88.14 52.07,87.36 52.07,86.96 51.4,86.29 51.4,86.26 51.36,86.22 50.85,86.22 50.68,86.39 U1.25
TX
  Top 0.152: R15.2 62.61,61.87 62.26,62.23 50.11,62.23 49.84,62.51 49.84,73.03 49.53,73.33 47.9,73.33 47.5,73.74 R18.1
USB_DM_IN
  Top 0.152: U1.46 R1.1
USB_DP_IN
  Top 0.152: U1.47 40.75,85.99 40.51,85.75 40.51,85.09 40.26,84.84 37.07,84.84 R2.1
USB_N
  Top 0.152: R1.2 34.49,86.39 33.87,85.76 23.08,85.76 23.02,85.82 22.5,86.33 22.5,92.14 21.69,92.95 J9.5 5.38,92.95 4.83,92.4 4.83,91.69 5.07,91.45 J9.8
USB_P
  Top 0.152: R2.2 34.49,84.86 33.87,85.48 22.96,85.48 22.23,86.22 22.23,92.02 21.8,92.45 J9.6 5.33,92.46 5.21,92.33 5.21,92.08 5.33,91.95 J9.7
V_USB
  Top 0.152: J9.2 5.52,94.55 5.4,94.43 4.39,94.43 4.19,94.23 | 4.19,90.3 4.64,89.85 4.76,89.97 5.4,89.97 5.52,89.85 J9.11
  Top 0.406: 4.19,94.23 4.19,90.3 | J9.11 7.94,89.85 8.13,89.66 8.13,78.49 | 8.13,78.49 8.13,76.96 7.75,76.58 2.67,76.58 2.32,76.23 D1.A | Q1.1 44.13,65.99 R7.2 44.03,67.09 43.31,67.82 24.64,67.82 23.19,69.27 23.19,75.86 21.71,77.34 9.27,77.34 8.13,78.49
VIN  (via drill 0.35, 0.38)
  Top 0.254: C13.1 10.54,73.46 10.29,73.46 10.46,73.28 U3.1 8.91,70.64 8.51,70.23 8.51,69.27 8.64,69.14 U3.2
  Top 0.305: U$1.1 60.3,93.14 v57.91,93.14 57.91,94.59 58.34,95.02 C19.2
  Top 0.406: D1.C 8.2,73.23 8.43,73.46 10.29,73.46 | Q1.2 v37.39,64.5 23.38,64.5 22.66,65.23 22.66,75.64 21.82,76.48 11.18,76.48 10.54,75.84 10.54,73.46
  Bottom 0.305: v37.39,64.5 37.39,91.14 37.9,91.64 57.2,91.64 57.61,92.05 57.61,92.84 v57.91,93.14
VOUT  (via drill 0.38)
  Top 0.152: U1.50 41.43,84.79 41.31,84.67 40.94,84.67 40.47,84.2 39.85,84.2 39.15,83.5 39.15,82.31 v38.66,81.81 C1.1 | U1.45 38.89,86.79 | 38.89,86.79 38.76,86.79 38.58,86.97 38.58,87.78 38.33,88.04 C3.1 | U1.23 51.8,85.59 v52.18,85.97 52.32,86.12 52.32,86.39 52.63,86.7 52.63,86.82 52.7,86.89 C2.1 | v38.91,86.88 38.91,86.81 38.89,86.79
  Bottom 0.152: v38.66,81.81 38.66,81.86 39.15,82.36 39.15,83.62 38.91,83.86 v38.91,86.88 39.41,86.88 39.89,86.4 47.07,86.4 47.51,85.95 52.16,85.95 v52.18,85.97
XIN
  Top 0.152: C20.1 63.02,72.8 62.66,73.15 62.66,73.08 Y1.2 57,72.75 56.67,73.08 56.67,80.62 56.24,81.05 52.2,81.05 51.94,81.31 51.94,84.02 51.58,84.39 U1.20
XOUT
  Top 0.152: R14.1 52.83,82.19 52.55,82.47 52.55,83.84 51.61,84.79 U1.21
XOUT_R
  Top 0.152: C21.1 63.07,82.32 Y1.1 58.3,82.25 R14.2

### Text on the board
tPlace: RST | BOOT | Citizen Science Badge
bPlace: SAVE THE AIR | VEHICLE EMISSION | COFFEE MACHINE | CROWDED ROOM | WARNING | NORMAL | This Badge belongs to: | Citizen Science Badge